# EAGLE design iot scheme (EAGLE 9.6.2)
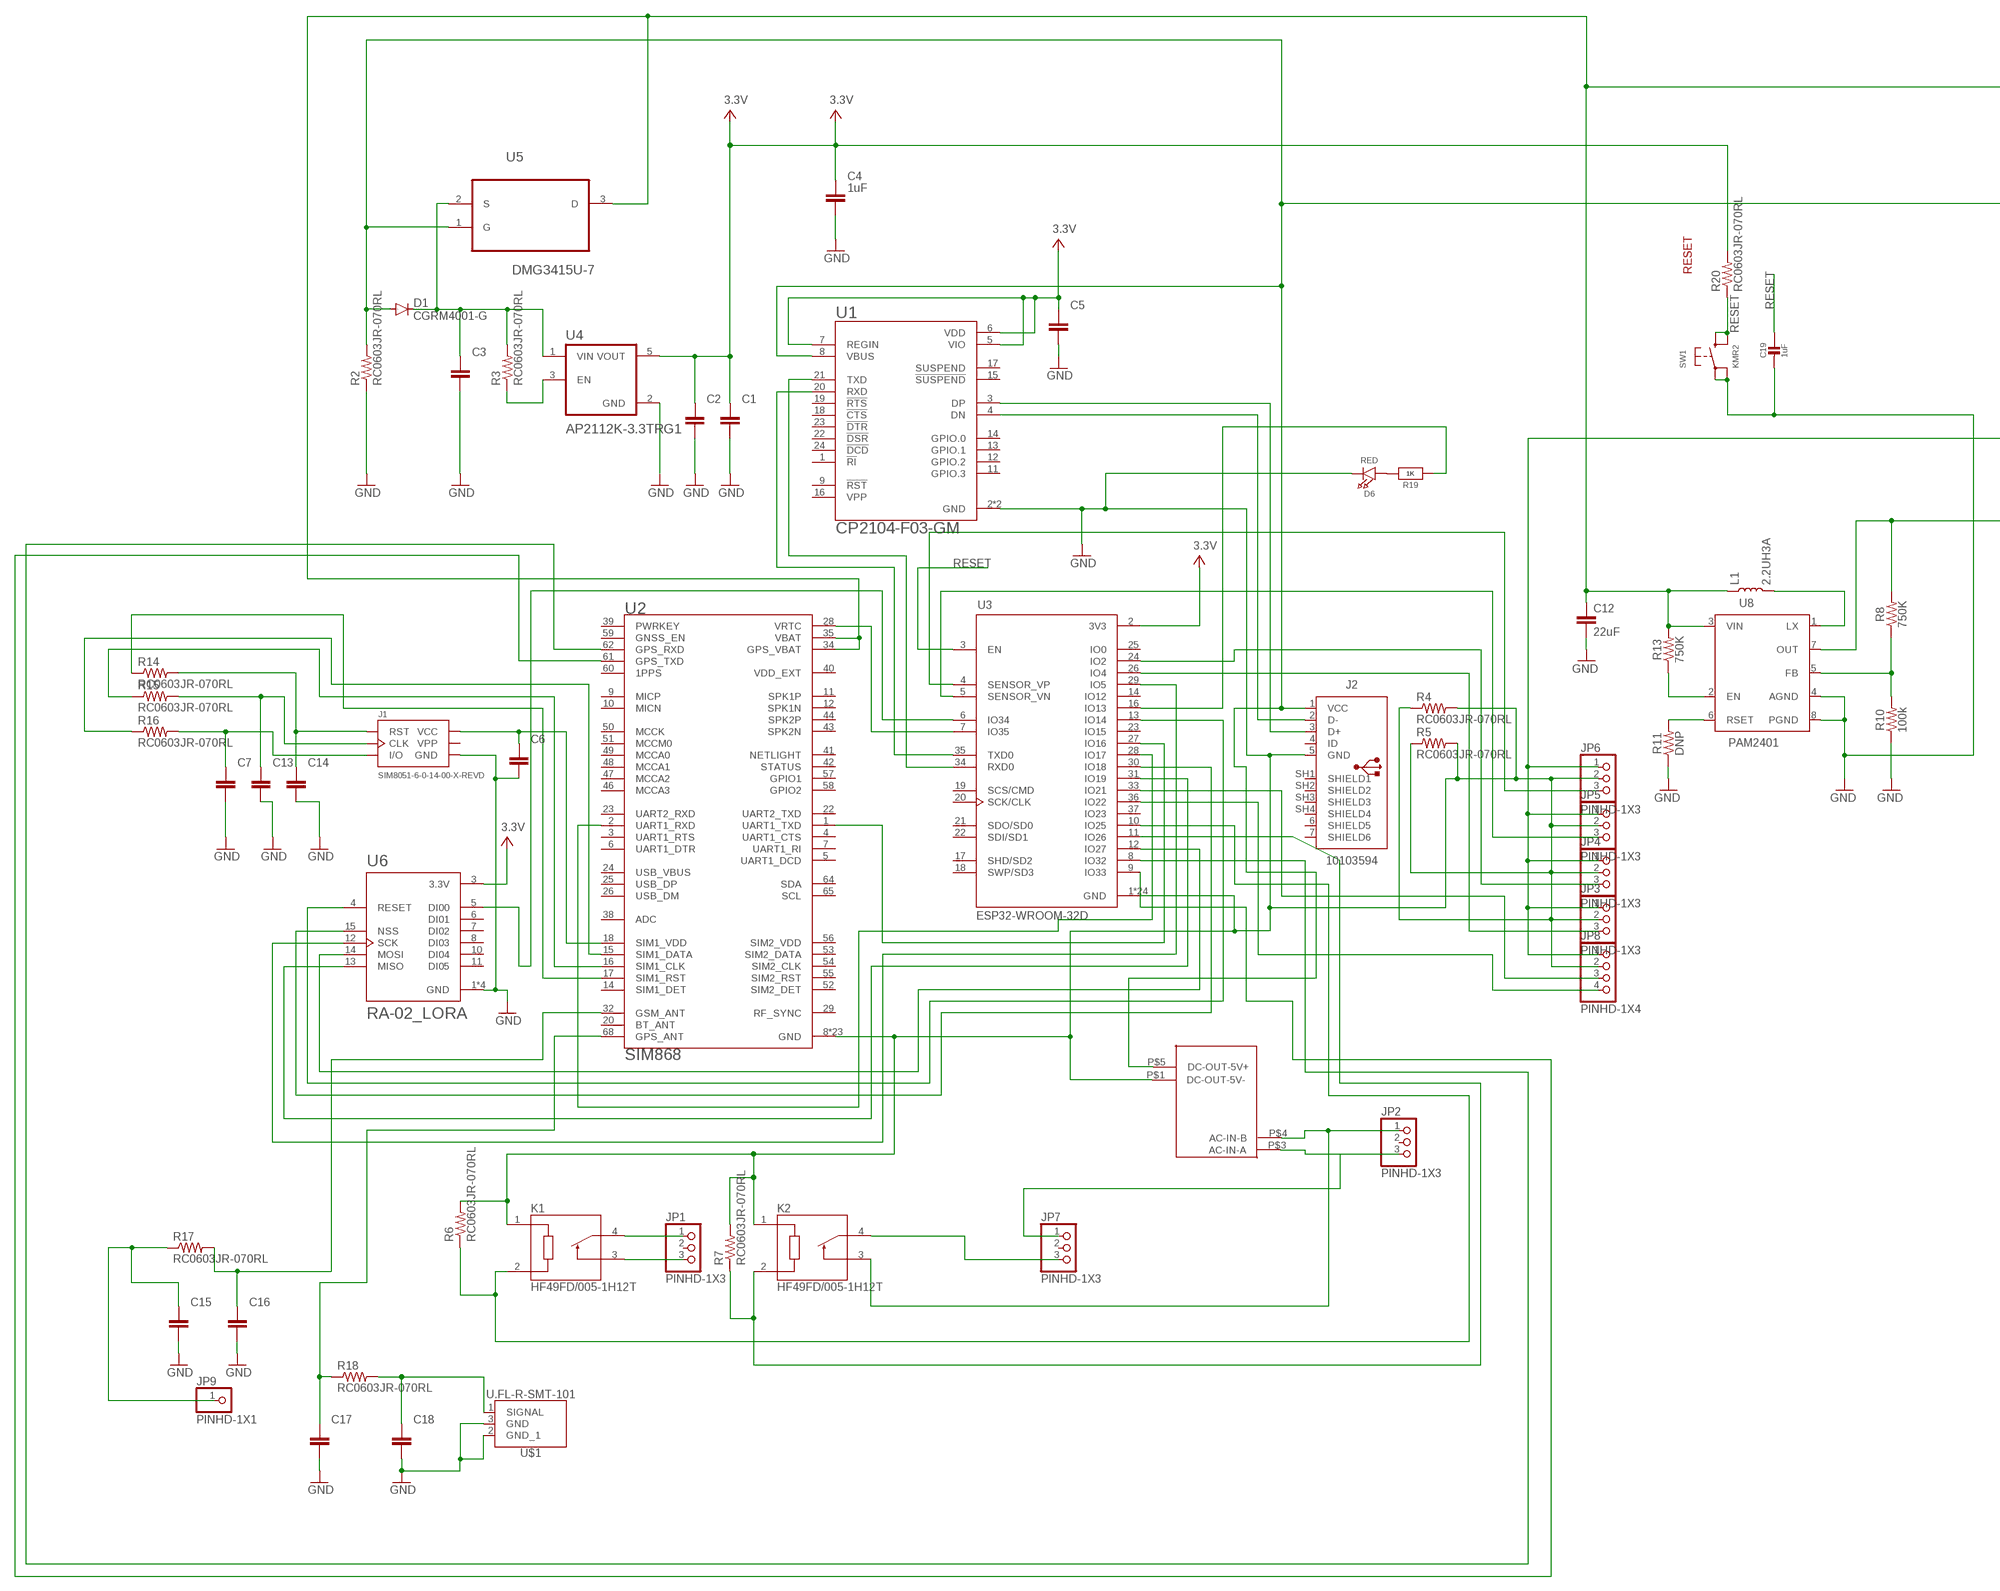
[diagram p0: schematic, sheet 1, part 1 of 2]
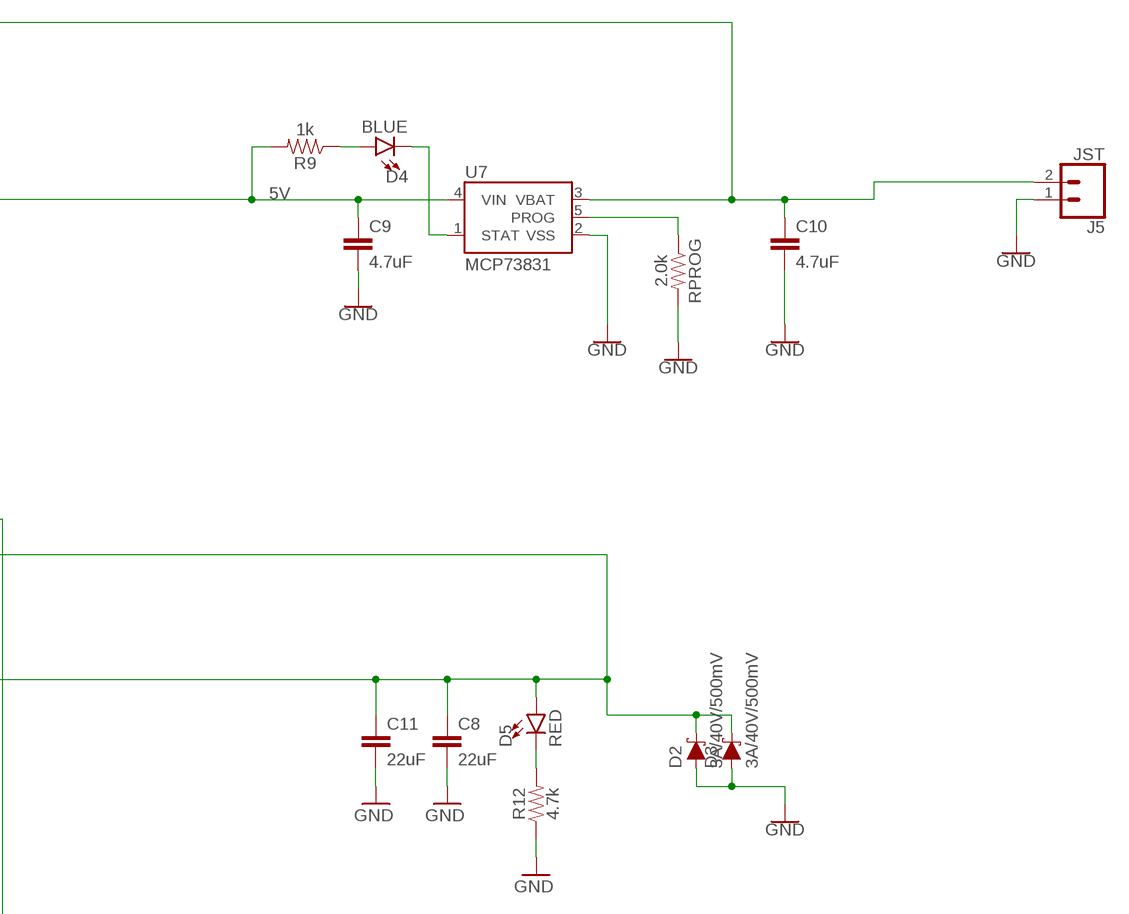
[diagram p1: schematic, sheet 1, part 2 of 2]

## Parts
C1  C_CHIP-0603(1608-METRIC)  [CAPC1608X85]
C2  C_CHIP-0603(1608-METRIC)  [CAPC1608X85]
C3  C_CHIP-0603(1608-METRIC)  [CAPC1608X85]
C4  1uF  C_CHIP-0603(1608-METRIC)  [CAPC1608X85]
C5  C_CHIP-0603(1608-METRIC)  [CAPC1608X85]
C6  C_CHIP-0603(1608-METRIC)  [CAPC1608X85]
C7  C_CHIP-0603(1608-METRIC)  [CAPC1608X85]
C8  22uF  22UF-0805-6.3V-20%  [0805]
C9  4.7uF  4.7UF0603  [0603]
C10  4.7uF  4.7UF0603  [0603]
C11  22uF  22UF-0805-6.3V-20%  [0805]
C12  22uF  22UF-0805-6.3V-20%  [0805]
C13  C_CHIP-0603(1608-METRIC)  [CAPC1608X85]
C14  C_CHIP-0603(1608-METRIC)  [CAPC1608X85]
C15  C_CHIP-0603(1608-METRIC)  [CAPC1608X85]
C16  C_CHIP-0603(1608-METRIC)  [CAPC1608X85]
C17  C_CHIP-0603(1608-METRIC)  [CAPC1608X85]
C18  C_CHIP-0603(1608-METRIC)  [CAPC1608X85]
C19  1uF  CAP_CERAMIC0603_NO  [0603-NO]
D1  CGRM4001-G  [SOD-123_MINI-SMA]
D2  3A/40V/500mV  DIODE-SCHOTTKY-B340A  [SMA-DIODE]
D3  3A/40V/500mV  DIODE-SCHOTTKY-B340A  [SMA-DIODE]
D4  BLUE  LED-BLUE0603  [LED-0603]
D5  RED  LED-RED0603  [LED-0603]
D6  RED  LED0805_NOOUTLINE  [CHIPLED_0805_NOOUTLINE]
J1  SIM8051-6-0-14-00-X-REVD  [GCT_SIM8051-6-0-14-00-X-REVD]
J2  10103594  [10103594]
J5  JST  CONN_02-JST-2MM-SMT  [JST-2-SMD]
JP1  PINHD-1X3  [1X03]
JP2  PINHD-1X3  [1X03]
JP3  PINHD-1X3  [1X03]
JP4  PINHD-1X3  [1X03]
JP5  PINHD-1X3  [1X03]
JP6  PINHD-1X3  [1X03]
JP7  PINHD-1X3  [1X03]
JP8  PINHD-1X4  [1X04]
JP9  PINHD-1X1  [1X01]
K1  HF49FD/005-1H12T  [RELAY_HF49FD/005-1H12T]
K2  HF49FD/005-1H12T  [RELAY_HF49FD/005-1H12T]
L1  2.2UH3A  INDUCTOR-IFSC1515AHER2R2M01  [INDUCTOR_4X4MM]
R1  AC-DC-5V  [MYFOOT]
R2  RC0603JR-070RL  [RES_0603]
R3  RC0603JR-070RL  [RES_0603]
R4  RC0603JR-070RL  [RES_0603]
R5  RC0603JR-070RL  [RES_0603]
R6  RC0603JR-070RL  [RES_0603]
R7  RC0603JR-070RL  [RES_0603]
R8  750K  750KOHM-0603-1/10W-1%  [0603]
R9  1k  1KOHM-0603-1/10W-1%  [0603]
R10  100k  100KOHM-0603-1/10W-1%  [0603]
R11  DNP  100KOHM-0603-1/10W-1%  [0603]
R12  4.7k  4.7KOHM-0603-1/10W-1%  [0603]
R13  750K  750KOHM-0603-1/10W-1%  [0603]
R14  RC0603JR-070RL  [RES_0603]
R15  RC0603JR-070RL  [RES_0603]
R16  RC0603JR-070RL  [RES_0603]
R17  RC0603JR-070RL  [RES_0603]
R18  RC0603JR-070RL  [RES_0603]
R19  1K  RESISTOR_0603_NOOUT  [0603-NO]
R20  RC0603JR-070RL  [RES_0603]
RPROG  2.0k  2.0KOHM-0603-1/10W-5%  [0603]
SW1  KMR2  SWITCH_TACT_SMT4.6X2.8  [BTN_KMR2_4.6X2.8]
U1  CP2104-F03-GM  [QFN50P400X400X80-25N]
U2  SIM868  [XCVR_SIM868]
U3  ESP32-WROOM-32D  [MODULE_ESP32-WROOM-32D]
U4  AP2112K-3.3TRG1  [SOT95P285X140-5N]
U5  DMG3415U-7  [SOT95P240X105-3N]
U6  RA-02_LORA  [MODULE_RA-02_LORA]
U7  MCP73831  [SOT23-5]
U8  PAM2401  [MSOP8]
U$1  U.FL-R-SMT-101  [U.FL-R-SMT-1(XX)]

## Nets
5V: C9.1 D1.A J2.1(VCC) R1.P$5(DC-OUT-5V+) R2.2 R9.2 U1.8(VBUS) U5.1(G) U7.4(VIN)
EN: R13.1 U8.2(EN)
GND: C1.2 C2.2 C3.2 C4.2 C5.2 C6.2 C7.2 C8.2 C9.2 C10.2 C11.2 C12.2 C13.2 C14.2 C15.2 C16.2 C17.2 C18.2 C19.2 D2.A D3.A D6.C J1.C5(GND) J2.5(GND) J5.1 JP3.2 JP4.2 JP5.2 JP6.2 JP8.2 K1.1(L1) K2.1(L1) R1.P$1(DC-OUT-5V-) R2.1 R4.1 R4.2 R5.1 R5.2 R6.2 R7.2 R10.1 R11.1 R12.1 RPROG.2 SW1.A'(P1) SW1.A(P) U1.2(GND) U1.25(GND) U2.8(GND) U2.13(GND) U2.19(GND) U2.21(GND) U2.27(GND) U2.30(GND) U2.31(GND) U2.33(GND) U2.36(GND) U2.37(GND) U2.45(GND) U2.63(GND) U2.66(GND) U2.67(GND) U2.69(GND) U2.70(GND) U2.71(GND) U2.72(GND) U2.73(GND) U2.74(GND) U2.75(GND) U2.76(GND) U2.77(GND) U3.1(GND) U3.15(GND) U3.38(GND) U3.39_1(GND) U3.39_2(GND) U3.39_3(GND) U3.39_4(GND) U3.39_5(GND) U3.39_6(GND) U3.39_7(GND) U3.39_8(GND) U3.39_9(GND) U3.39_10(GND) U3.39_11(GND) U3.39_12(GND) U3.39_13(GND) U3.39_14(GND) U3.39_15(GND) U3.39_16(GND) U3.39_17(GND) U3.39_18(GND) U3.39_19(GND) U3.39_20(GND) U3.39_21(GND) U4.2(GND) U6.1(GND) U6.2(GND) U6.9(GND) U6.16(GND) U7.2(VSS) U8.4(AGND) U8.8(PGND) U$1.2(GND_1) U$1.3(GND)
N$1: L1.P$2 U8.1(LX)
N$2: J2.3(D+) U1.3(DP)
N$3: J2.2(D-) U1.4(DN)
N$4: R3.1 U4.3(EN)
N$5: U1.20(RXD) U3.35(TXD0)
N$6: U1.21(TXD) U3.34(RXD0)
N$7: C3.1 D1.C R3.2 U4.1(VIN) U5.2(S)
N$8: R11.2 U8.6(RSET)
N$9: JP2.1 K2.3(C2) R1.P$4(AC-IN-B)
N$10: D5.C R12.2
N$11: RPROG.1 U7.5(PROG)
N$12: R8.1 R10.2 U8.5(FB)
N$13: D4.A R9.1
N$14: D4.C U7.1(STAT)
N$15: JP2.3 JP7.1 R1.P$3(AC-IN-A)
N$16: JP1.1 K1.4(C1)
N$17: JP1.3 K1.3(C2)
N$18: JP7.3 K2.4(C1)
N$19: JP6.3 U3.4(SENSOR_VP)
N$20: D6.A R19.2
N$21: JP5.3 U3.5(SENSOR_VN)
N$22: JP8.3 U3.33(IO21)
N$23: JP8.4 U3.36(IO22)
N$24: JP4.3 U3.24(IO2)
N$25: JP3.3 U3.26(IO4)
N$26: U3.13(IO14) U6.4(RESET)
N$27: K1.2(L2) R6.1 U3.10(IO25)
N$28: K2.2(L2) R7.1 U3.11(IO26)
N$29: U3.30(IO18) U6.15(NSS)
N$30: U3.12(IO27) U6.14(MOSI)
N$31: U3.31(IO19) U6.13(MISO)
N$32: U3.29(IO5) U6.12(SCK)
N$33: U3.6(IO34) U6.5(DI00)
N$34: U2.1(UART1_TXD) U3.27(IO16)
N$35: U2.2(UART1_RXD) U3.28(IO17)
N$36: C6.1 J1.C1(VCC) U2.18(SIM1_VDD)
N$37: R15.1 U2.16(SIM1_CLK)
N$38: R14.1 U2.17(SIM1_RST)
N$39: C14.1 J1.C2(RST) R14.2
N$40: C13.1 J1.C3(CLK) R15.2
N$41: C7.1 J1.C7(I/O) R16.2
N$42: R16.1 U2.15(SIM1_DATA)
N$43: C16.1 R17.2 U2.32(GSM_ANT)
N$44: C17.1 R18.1 U2.68(GPS_ANT)
N$45: C15.1 JP9.1 R17.1
N$46: U2.28(VRTC) U3.7(IO35)
N$47: C18.1 R18.2 U$1.1(SIGNAL)
N$48: C8.1 C11.1 D2.C D3.C D5.A JP3.1 JP4.1 JP5.1 JP6.1 JP8.1 R8.2 U8.7(OUT)
N$49: U2.62(GPS_RXD) U3.8(IO32)
N$50: R19.1 U3.16(IO13)
N$52: U2.61(GPS_TXD) U3.9(IO33)
RESET: C19.1 R20.1 SW1.B'(S1) SW1.B(S) U3.3(EN)
V+: C1.1 C2.1 C4.1 C5.1 R20.2 U1.5(VIO) U1.6(VDD) U1.7(REGIN) U3.2(3V3) U4.5(VOUT) U6.3(3.3V) ; supply symbol labelled 3.3V
VBATT: C10.1 C12.1 J5.2 L1.P$1 R13.2 U2.34(GPS_VBAT) U2.35(VBAT) U5.3(D) U7.3(VBAT) U8.3(VIN)
Unconnected: J2.4(ID) J2.6(SHIELD5) J2.7(SHIELD6) J2.SH1(SHIELD1) J2.SH2(SHIELD2) J2.SH3(SHIELD3) J2.SH4(SHIELD4) JP1.2 JP2.2 JP7.2 U1.1(!RI) U1.9(!RST!) U1.11(GPIO.3) U1.12(GPIO.2) U1.13(GPIO.1) U1.14(GPIO.0) U1.15(!SUSPEND!) U1.16(VPP) U1.17(SUSPEND) U1.18(!CTS) U1.19(!RTS) U1.22(!DSR) U1.23(!DTR) U1.24(!DCD) U2.3(UART1_RTS) U2.4(UART1_CTS) U2.5(UART1_DCD) U2.6(UART1_DTR) U2.7(UART1_RI) U2.9(MICP) U2.10(MICN) U2.11(SPK1P) U2.12(SPK1N) U2.14(SIM1_DET) U2.20(BT_ANT) U2.22(UART2_TXD) U2.23(UART2_RXD) U2.24(USB_VBUS) U2.25(USB_DP) U2.26(USB_DM) U2.29(RF_SYNC) U2.38(ADC) U2.39(PWRKEY) U2.40(VDD_EXT) U2.41(NETLIGHT) U2.42(STATUS) U2.43(SPK2N) U2.44(SPK2P) U2.46(MCCA3) U2.47(MCCA2) U2.48(MCCA1) U2.49(MCCA0) U2.50(MCCK) U2.51(MCCM0) U2.52(SIM2_DET) U2.53(SIM2_DATA) U2.54(SIM2_CLK) U2.55(SIM2_RST) U2.56(SIM2_VDD) U2.57(GPIO1) U2.58(GPIO2) U2.59(GNSS_EN) U2.60(1PPS) U2.64(SDA) U2.65(SCL) U3.14(IO12) U3.17(SHD/SD2) U3.18(SWP/SD3) U3.19(SCS/CMD) U3.20(SCK/CLK) U3.21(SDO/SD0) U3.22(SDI/SD1) U3.23(IO15) U3.25(IO0) U3.37(IO23) U6.6(DI01) U6.7(DI02) U6.8(DI03) U6.10(DI04) U6.11(DI05)

## Notes on the sheet
- RESET

## Power pins joined to a net without a drawn wire
VPP: J1.C6(VPP)

## Library data of the parts
C1-C7 C13-C18 = Capacitor:C: Capacitor - Generic; CATEGORY: Capacitor
C8 C11 C12 = SparkFun-Capacitors:22UF: 22µF ceramic capacitors A capacitor is a passive two-terminal electrical component used to store electrical energy temporarily in an electric field.; PROD_ID: CAP-08402
C9 C10 = SparkFun-Capacitors:4.7UF: 4.7µF ceramic capacitors A capacitor is a passive two-terminal electrical component used to store electrical energy temporarily in an electric field.; PROD_ID: CAP-08280
C19 = microbuilder:CAP_CERAMIC: Ceramic Capacitors For new designs, use the packages preceded by an '_' character since they are more reliable: The following footprints should be used on most boards: _0402 - Standard footprint for regular board layouts _0603 - Standard footprint for regular board layouts _0805 - Standard footprint for regular board layouts _1206 - Standard footprint for regular board layouts For extremely tight-pitch boards where space is at a premium, the following 'micro-pitch' footprints can be used (smaller pads, no silkscreen outline, etc.): _0402MP - Micro-pitch footprint for very dense/compact boards _0603MP - Micro-pitch footprint for very dense/compact boards _0805MP - Micro-pitch footprint for very dense/compact boards _1206MP - Micro-pitch footprint for very dense/compact boards
D1 = diode:CGRM400*-G: Molded plasitc,JEDEC SOD-123/Mini SMA Source: Comchip CGRM4001-G.pdf
D2 D3 = SparkFun-DiscreteSemi:DIODE-SCHOTTKY: Schottky diode A Schottky diode is a semiconductor diode which has a low forward voltage drop and a very fast switching action.; PROD_ID: DIO-09886
D4 = SparkFun-LED:LED-BLUE: Blue SMD LED Used in manufacturing of various products at SparkFun Packages: 0603 - SMD 0603 package [Product Link] <http://www.digikey.com/product-detail/en/SMLE12BC7TT86/511-1589-2-ND/1641808> 1206 - SMD1206 package [Product Link] <http://www.digikey.com/product-detail/en/lite-on-inc/LTST-C150TBKT/160-1643-1-ND/573584> SparkFun Products: ESP8266 Thing-Dev Board <https://www.sparkfun.com/products/13711> RedBoard <https://www.sparkfun.com/products/12757>; PROD_ID: DIO-08575
D5 = SparkFun-LED:LED-RED: Red SMD LED Used in manufacturing of most products at SparkFun Packages: 0603 - SMD 0603 package [Product Link] <http://docs.avagotech.com/docs/AV02-0551EN> 0603 SMART - SMD 0603 SMART package ( more efficient and expensive)[Product Link] <http://www.osram-os.com/Graphics/XPic2/00077099_0.pdf> 1206 - SMD1206 package [Product Link] <https://www.sparkfun.com/datasheets/DevTools/LilyPad/Q150OVS4.pdff> SparkFun Products: Pro Mini 328 -5V <https://www.sparkfun.com/products/821> RedBoard <https://www.sparkfun.com/products/12757> IOIO-OTG <https://www.sparkfun.com/products/13613>; PROD_ID: DIO-00819
D6 = microbuilder:LED: LED 0603 - 0603 Surface Mount Package 2mA: Green LED - Low Power (3.9mcd, 2ma, 1.7Vf) - Digikey: 475-2709-2-ND Orange LED - Low Power (9.8mcd, 2ma, 1.8Vf) - Digikey: 475-1194-2-ND Red LED - Low Power (5mcd, 2ma, 1.8Vf) - Digikey: 475-1195-2-ND Yellow LED - Low Power (7mcd, 2ma, 1.8Vf) - Digikey: 475-1196-2-ND 5mA: Blue LED - Low Power (17mcd, 5ma, 2.9Vf) - Digikey: LNJ937W8CRACT-ND 0805 - 0805 Surface Mount Package 2mA: Red LED (8.8mcd, 2mA, 1.8Vf, Clear) - Low Power [Digikey: 475-2510-1-ND] Green LED (5mcd, 2mA, 1.8Vf, Clear) - Low Power [Digikey: 475-2730-1-ND] Yellow LED (11.3mcd, 2mA, 1.8Vf, Clear) - Low Power [Digikey: 475-2555-1-ND] 20mA: Red LED (104mcd, 20mA, Diffused) - LS R976 [Digikey: 475-1278-6-ND] Red LED (12mcd, 20mA, 2.0Vf, Clear) - APT2012EC [Digikey: 754-1128-1-ND] Green LED (15mcd, 20mA, 2.2Vf, Clear) - APT2012GC [Digikey: 754-1131-1-ND] Orange LED (160mcd, 20mA, 2.1Vf, Clear) - APT2012SECK [Digikey: 754-1130-1-ND] 1206 - 1206 Surface Mount Package Green LED (26mcd, 20mA, Diffused) - LG N971 [Digikey: 475-1407-6-ND] Red LED (15mcd, 20mA, Diffused) - LH N974 [Digikey: 475-1416-6-ND] Cree - Cree High-Power Surface Mount LEDs XPEBWT-L1-0000-00D50 - White 111lm 350mA 2.9Vf 6200K 110° XTEAWT-00-0000-00000LEE3 - White 114lm 350mA 2.85Vf 5000K 115° Everlight - Everlight 45-21 Series Surface Mount LEDs 45-21/QK2C-B2832AC2CB2/2T - Warm White 2000mcd 20mA 3.25Vf 3050K 120° 45-21/LK2C-B38452C4CB2/2T - Nuetral White 2000mcd 20mA 3.25Vf 4150K 120° 45-21/LK2C-B50634C6CB2/2T - Cold White 2200mcd 20mA 3.25Vf 5650K 120° PLCC2 Reverse Mount LS T77K-J1L2-1-0-2-R18-Z - Red 11.25mcd 2mA 1.8Vf 630nm 120° LO T77K-L1M2-24-Z - Orange 19.6mcd 2mA 1.8Vf 606nm 120° LY T77K-K2M1-26-Z - Yellow 15.7mcd 2mA 1.8Vf 587nm 120°
J1 = SIM8051-6-0-14-00-X-REVD:SIM8051-6-0-14-00-X-REVD: Nano SIM Card Connector, Push-Pull Type, 6 Pin, SMT, Profile 1.35mm Check prices <https://pricing.snapeda.com/parts/SIM8051-6-0-14-00-A/Global%20Connector%20Technology/view-part?ref=eda>; AVAILABILITY: In Stock; DESCRIPTION: 6 Position Card Connector NANO SIM Surface Mount, Right Angle Gold; MF: Global Connector Technology; MP: SIM8051-6-0-14-00-A; PACKAGE: None; PRICE: None
J2 = Connector_USB:10103594: USB(2.0) Micro-B, RCPT, 5POS, SMD-THT-R/A Datasheet <https://cdn.amphenol-icc.com/media/wysiwyg/files/documentation/datasheet/inputoutput/io_usb_micro.pdf> Drawing <https://cdn.amphenol-icc.com/media/wysiwyg/files/drawing/10103594.pdf>; CATEGORY: Connectors; CONTACTS: 5; CURRENT-RATING: 1.8A; DESCRIPTION: CONN RCPT USB2.0 MICRO B SMD R/A; GENDER: Receptacle; MANUFACTURER: Amphenol ICC (FCI); MOUNT_TYPE: R/A; MPN: 10103594-0001LF; OPERATING_TEMPERATURE: -30°C ~ 80°C; PART_STATUS: ACTIVE; ROHS_COMPLIANT: COMPLIANT; SUB_CATEGORY: USB; TYPE: USB-micro B; VOLTAGE-RATING: 100VAC
J5 = SparkFun-Connectors:CONN_02: Multi connection point. Often used as Generic Header-pin footprint for 0.1 inch spaced/style header connections On any of the 0.1 inch spaced packages, you can populate with these: Break Away Headers - Straight <https://www.sparkfun.com/products/116> (PRT-00116) Break Away Male Headers - Right Angle <https://www.sparkfun.com/products/553> (PRT-00553) Female Headers <https://www.sparkfun.com/products/115> (PRT-00115) Break Away Headers - Machine Pin <https://www.sparkfun.com/products/117> (PRT-00117) Break Away Female Headers - Swiss Machine Pin <https://www.sparkfun.com/products/743> (PRT-00743) For SCREWTERMINALS and SPRING TERMINALS visit here: Screw Terimnals on SparkFun.com <https://www.sparkfun.com/search/results?term=Screw+Terminals> (5mm/3.5mm/2.54mm spacing) This device is also useful as a general connection point to wire up your design to another part of your project. Our various solder wires solder well into these plated through hole pads. Hook-Up Wire - Assortment (Stranded, 22 AWG) <https://www.sparkfun.com/products/11375> (PRT-11375) Hook-Up Wire - Assortment (Solid Core, 22 AWG) <https://www.sparkfun.com/products/11367> (PRT-11367) View the entire wire category on our website here <https://www.sparkfun.com/categories/141> Special notes: Molex polarized connector foot print use with: PRT-08233 with associated crimp pins and housings. 2.54_SCREWTERM for use with PRT-10571. 3.5mm Screw Terminal footprints for PRT-08084 5mm Screw Terminal footprints for use with PRT-08432; PROD_ID: CONN-11443
JP1-JP7 = Connector:PINHD-1X3: PIN HEADER; CATEGORY: CONNECTOR; SUB-CATEGORY: PIN-HEADER
JP8 = Connector:PINHD-1X4: PIN HEADER; CATEGORY: CONNECTOR; SUB-CATEGORY: PIN-HEADER
JP9 = Connector:PINHD-1X1: PIN HEADER; CATEGORY: CONNECTOR; SUB-CATEGORY: PIN-HEADER
K1 K2 = HF49FD_005-1H12T:HF49FD/005-1H12T: Relay: electromagnetic; SPST-NO; Ucoil: 5VDC; 5A/250VAC; 5A/30VDC Check prices <https://pricing.snapeda.com/parts/HF49FD/005-1H12T/Hongfa/view-part?ref=eda>; AVAILABILITY: No availability data; DESCRIPTION: Relay: electromagnetic; SPST-NO; Ucoil: 5VDC; 5A/250VAC; 5A/30VDC; MF: Hongfa; MP: HF49FD/005-1H12T; PACKAGE: None; PRICE: None
L1 = SparkFun-Coils:INDUCTOR: Inductors Resist changes in electrical current. Basically a coil of wire. SparkFun Products: SparkFun Load Cell Amplifier - HX711 <https://www.sparkfun.com/products/13879> IOIO-OTG - V2.2 <https://www.sparkfun.com/products/13613>; PROD_ID: NDUC-13770
R1 = my1:AC-DC-5V
R2-R7 R14-R18 R20 = Resistor_Capacitor:RC0603JR-070RL: RES SMD 0 OHM JUMPER 1/10W 0603 Manufacturer's datasheet <http://www.yageo.com/documents/recent/PYu-RC_Group_51_RoHS_L_10.pdf>; CREATED_BY: PCBLayout.com; DIGIKEY_PART_NUMBER: 311-0.0GRTR-ND; MANUFACTURER: Yageo; MPN: RC0603JR-070RL; PACKAGE: SMD 0603
R8 R13 = SparkFun-Resistors:750KOHM: 750Ω resistor A resistor is a passive two-terminal electrical component that implements electrical resistance as a circuit element. Resistors act to reduce current flow, and, at the same time, act to lower voltage levels within circuits. - Wikipedia; PROD_ID: RES-13768
R9 = SparkFun-Resistors:1KOHM: 1kΩ resistor A resistor is a passive two-terminal electrical component that implements electrical resistance as a circuit element. Resistors act to reduce current flow, and, at the same time, act to lower voltage levels within circuits. - Wikipedia; PROD_ID: RES-07856
R10 = SparkFun-Resistors:100KOHM: 100kΩ resistor A resistor is a passive two-terminal electrical component that implements electrical resistance as a circuit element. Resistors act to reduce current flow, and, at the same time, act to lower voltage levels within circuits. - Wikipedia; PROD_ID: RES-07828
R11 = SparkFun-Resistors:100KOHM: 100kΩ resistor A resistor is a passive two-terminal electrical component that implements electrical resistance as a circuit element. Resistors act to reduce current flow, and, at the same time, act to lower voltage levels within circuits. - Wikipedia; PROD_ID: RES-07828; VALUE: 100k
R12 = SparkFun-Resistors:4.7KOHM: 4.7kΩ resistor A resistor is a passive two-terminal electrical component that implements electrical resistance as a circuit element. Resistors act to reduce current flow, and, at the same time, act to lower voltage levels within circuits. - Wikipedia; PROD_ID: RES-07857
R19 = microbuilder:RESISTOR: Resistors For new designs, use the packages preceded by an '_' character since they are more reliable: The following footprints should be used on most boards: _0402 - Standard footprint for regular board layouts _0603 - Standard footprint for regular board layouts _0805 - Standard footprint for regular board layouts _1206 - Standard footprint for regular board layouts For extremely tight-pitch boards where space is at a premium, the following 'micro-pitch' footprints can be used (smaller pads, no silkscreen outline, etc.): _0402MP - Micro-pitch footprint for very dense/compact boards _0603MP - Micro-pitch footprint for very dense/compact boards _0805MP - Micro-pitch footprint for very dense/compact boards _1206MP - Micro-pitch footprint for very dense/compact boards
RPROG = SparkFun-Resistors:2.0KOHM: 2kΩ resistor A resistor is a passive two-terminal electrical component that implements electrical resistance as a circuit element. Resistors act to reduce current flow, and, at the same time, act to lower voltage levels within circuits. - Wikipedia; PROD_ID: RES-08296
SW1 = microbuilder:SWITCH_TACT_SMT: SMT Tact Switches 6x6mm - Digikey: P12940SCT-ND KMR2 (4.6x2.8mm) - Digikey: 401-1426-1-ND EVQ-PQHB55 - Light Touch, 160GF (4.5x4.5mm) - Digikey: P8090SCT-ND KMT0 - KMT021 NGJ LHS (etc.) IP68/Waterproof - Digikey: CKN10289CT-ND
U1 = CP2104:CP2104: Silabs CP2104 USB to UART Bridge Check prices <https://pricing.snapeda.com/parts/CP2104/Silicon%20Labs/view-part?ref=eda>; AVAILABILITY: In Stock; DESCRIPTION: USB Bridge, USB to UART USB 2.0 UART Interface 24-QFN (4x4); MF: Silicon Labs; MP: CP2104; PACKAGE: QFN-24 Silicon Labs; PRICE: None
U2 = SIM868 (1):SIM868: Gsm/Gprs+Gnss Module Check prices <https://pricing.snapeda.com/parts/SIM868/MikroElektronika/view-part?ref=eda>; AVAILABILITY: No availability data; DESCRIPTION: SIM868 GNSS, GSM RF mikroBUS™ Click™ Platform Evaluation Expansion Board; MF: MikroElektronika; MP: SIM868; PACKAGE: None; PRICE: None
U3 = ESP32-WROOM-32D:ESP32-WROOM-32D: Bluetooth, WiFi 802.11b/g/n, Bluetooth v4.2 + EDR, Class 1, 2 and 3 Transceiver Module 2.4GHz ~ 2.5GHz Integrated, Trace Surface Mount Check prices <https://pricing.snapeda.com/parts/ESP32-WROOM-32D/Espressif%20Systems/view-part?ref=eda>; AVAILABILITY: In Stock; DESCRIPTION: Bluetooth, WiFi 802.11b/g/n, Bluetooth v4.2 +EDR, Class 1, 2 and 3 Transceiver Module 2.4GHz ~ 2.5GHz Integrated; MF: Espressif Systems; MP: ESP32-WROOM-32D; PACKAGE: Module Espressif Systems; PRICE: None
U4 = AP2112K-3.3TRG1:AP2112K-3.3TRG1: AP2112 Series 0.6 A 3.3 V Fixed Output SMT LDO Linear Regulator - SOT23-5 Check prices <https://pricing.snapeda.com/parts/AP2112K-3.3TRG1/Diodes%20Zetex/view-part?ref=eda>; AVAILABILITY: In Stock; DESCRIPTION: LDO Regulator Pos 3.3V 0.6A 5-Pin SOT-23 T/R; MF: Diodes Zetex; MP: AP2112K-3.3TRG1; PACKAGE: None; PRICE: None
U5 = DMG3415U-7:DMG3415U-7: P-CHANNEL ENHANCEMENT MODE MOSFET Check prices <https://pricing.snapeda.com/parts/DMG3415U-7/Diodes%20Inc./view-part?ref=eda>; AVAILABILITY: Not in stock; DESCRIPTION: P-Channel 20V 4A (Ta) 900mW (Ta) Surface Mount SOT-23-3; MF: Diodes Inc.; MP: DMG3415U-7; PACKAGE: SOT-23 Diodes Inc.; PRICE: None
U6 = RA-02_LORA:RA-02_LORA: Ra-02 LoRa RF M5Stack Platform Evaluation Expansion Board Check prices <https://pricing.snapeda.com/parts/Ra-02%20LoRa/AI-Thinker/view-part?ref=eda>; AVAILABILITY: No availability data; DESCRIPTION: Ra-02 LoRa RF M5Stack Platform Evaluation Expansion Board; MF: AI-Thinker; MP: Ra-02 LoRa; PACKAGE: Package; PRICE: None
U7 = SparkFun-IC-Power:MCP73831: MCP73831T Li-Ion, Li-Pol Controller Miniature single cell, fully integrated Li-Ion, Li-polymer charge management controller Datasheet <http://ww1.microchip.com/downloads/en/DeviceDoc/20001984g.pdf> SparkFun Products: SparkFun ESP32 Thing <https://www.sparkfun.com/products/13907> SparkFun 9DoF Razor IMU M0 <https://www.sparkfun.com/products/14001>; PROD_ID: IC-09995
U8 = SparkFun-IC-Power:PAM2401: PAM2401 - Boost PMIC Specifications: Up to 1A output current 0.9V to 4.75V Input Range 2.5V to 5.0V Adjustable Output Voltage Datasheet <https://www.diodes.com/assets/Datasheets/PAM2401.pdf> (Diodes inc.); PROD_ID: IC-13769
U$1 = Connector:U.FL-R-SMT-1: U.FL (UMCC) Connector Receptacle, Male Pin 50Ohm Surface Mount Solder Datasheet <https://media.digikey.com/pdf/Data%20Sheets/Hirose%20PDFs/UFL%20Series.pdf> Drawing <https://www.hirose.com/product/document?clcode=CL0331-0472-2-10&productname=U.FL-R-SMT-1(10)&series=U.FL&documenttype=2DDrawing&lang=en&documentid=0000940684>; CATEGORY: Connector; DESCRIPTION: Ultra Small Surface Mount Coaxial Connectors; MANUFACTURER: Hirose Electric Co Ltd; MPN: U.FL-R-SMT-1(01); OPERATING_TEMPERATURE: -40˚C to +90˚C; PART_STATUS: Active; ROHS_COMPLIANCE: RoHS Compliant; SERIES: U.FL; TYPE: RF Connector

## Board
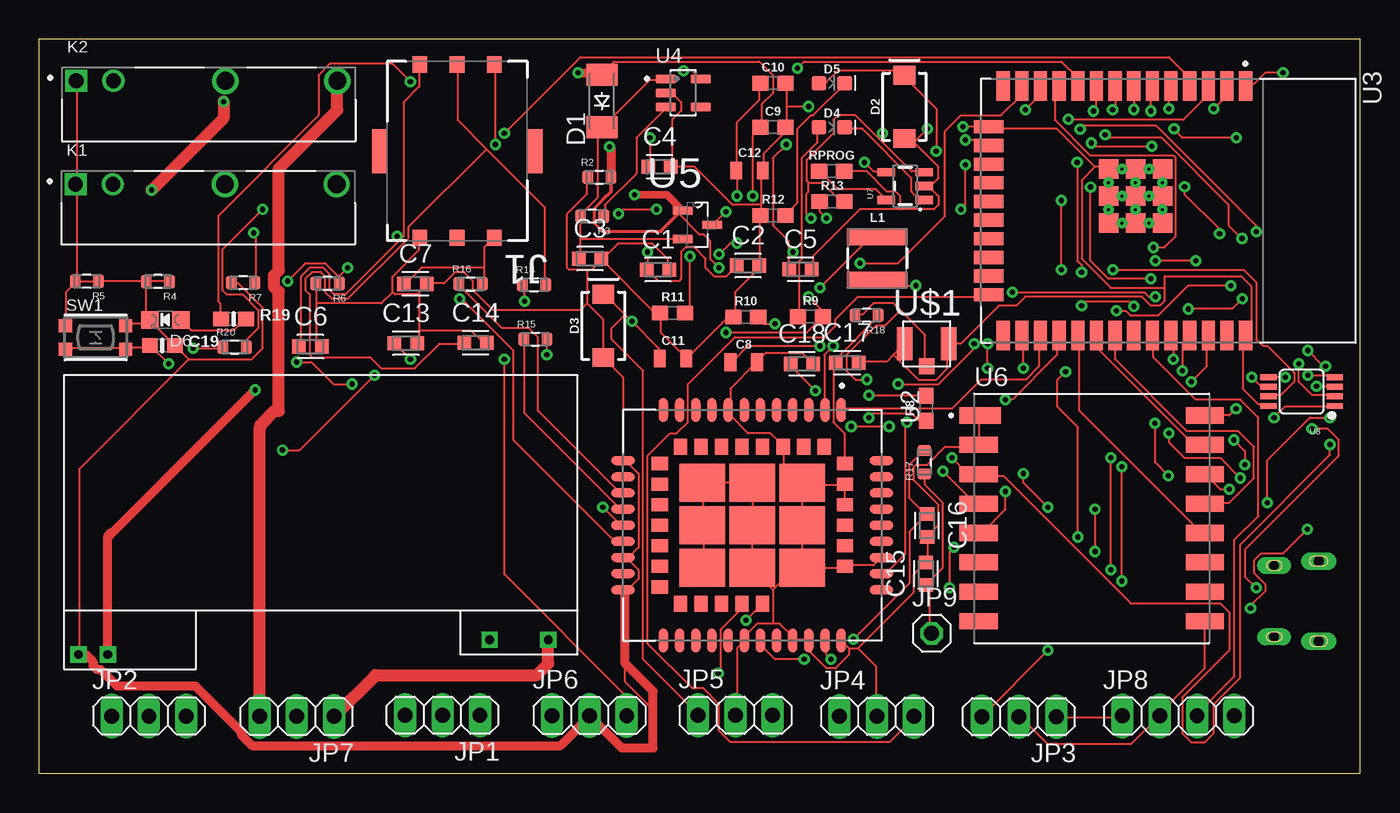
[diagram p2: board, top side]
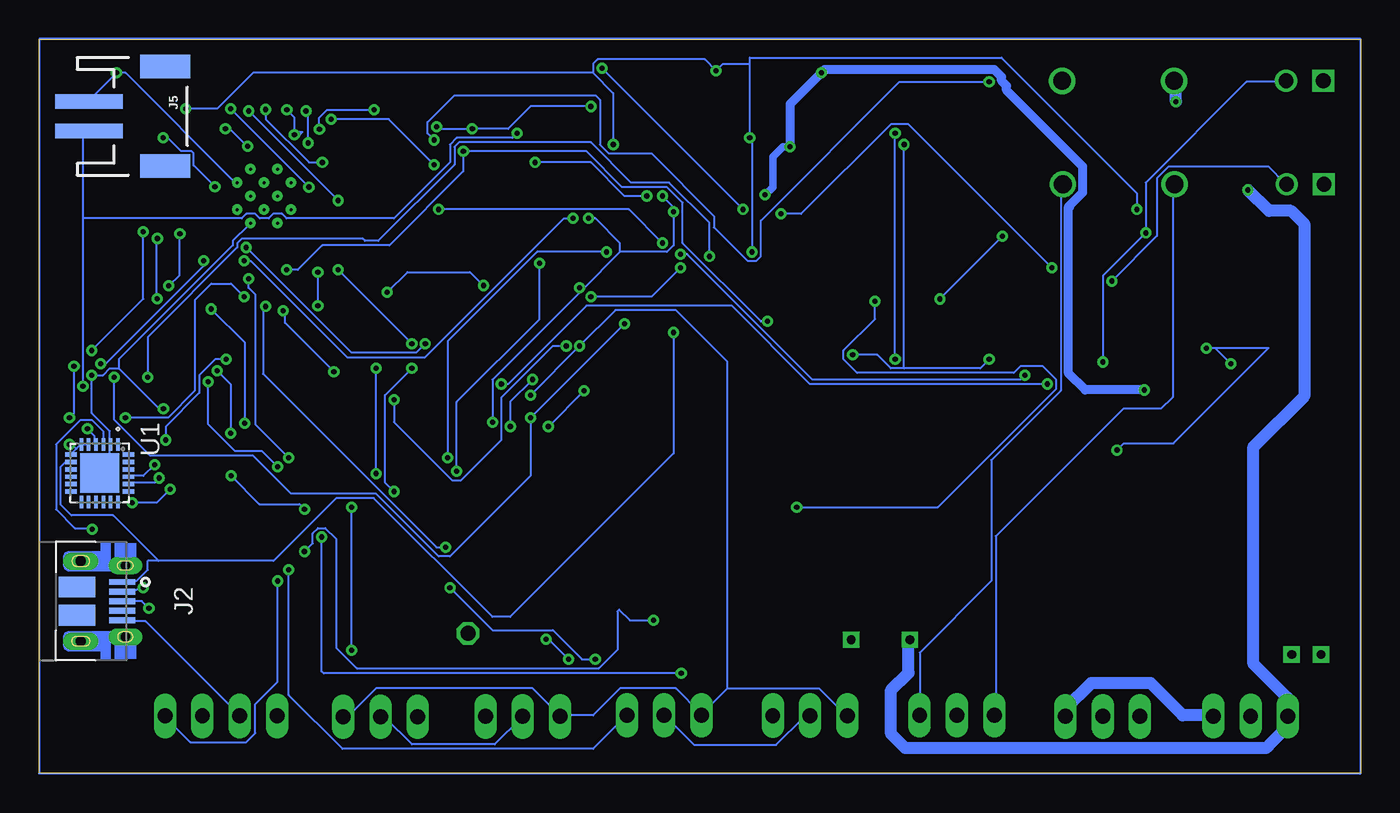
[diagram p3: board, bottom side, seen from below]

Size 90 x 50 mm. Coordinates in mm from the lower left corner, seen from the top.
Outline: 0,0 90,0 90,50 0,50 0,0
Copper layers (1*16): Top 0.035mm / dielectric 1.5mm / Bottom 0.035mm
Design rules "default": minimum track width 6mil, minimum drill 0.35mm, track to track 6mil, track to pad 6mil, pad to pad 6mil, via to via 6mil, smd to smd 6mil, copper to edge 40mil, drill to drill 6mil, minimum pad ring 10mil, minimum via ring 8mil, stop-mask expansion 4mil, vias tented up to drill 0mil, thermal gap 10mil

### Footprints (pad centres in the part's own frame; a part is rotated, then mirrored left to right if it is on the bottom)
CAPC1608X85 = smd 0.921 x 0.97: 1 -0.775,0; 2 0.775,0
0805 = smd 0.8 x 1.2: 1 -0.9,0; 2 0.9,0
0603 = smd 1.1 x 1: 1 -0.85,0; 2 0.85,0
0603-NO = smd 1.075 x 1: 1 -0.85,0; 2 0.85,0
SOD-123_MINI-SMA = smd 1.5 x 2.1: A 1.8,0; C -1.8,0
SMA-DIODE = smd 1.27 x 1.47: A -2.15,0; C 2.15,0
LED-0603 = smd 1 x 1: A -0.877,0; C 0.877,0
CHIPLED_0805_NOOUTLINE = smd 1.2 x 1.2: A 0,-1.05; C 0,1.05
GCT_SIM8051-6-0-14-00-X-REVD = smd 1 x 1.1: C1 2.54,-5.9; C2 0,-5.9; C3 -2.54,-5.9; C5 2.54,5.9; C6 0,5.9; C7 -2.54,5.9 | smd 1 x 3: C4 5.3,0; C8 -5.3,0
10103594 = smd 0.4 x 1.75: 1 -1.3,2.825; 2 -0.65,2.825; 3 0,2.825; 4 0.65,2.825; 5 1.3,2.825 | smd 1.425 x 2.5: 6 -0.963,-0.25; 7 0.963,-0.25 | drill 0.65 pad 0.73 long: SH1 -2.425,3.03; SH2 2.425,3.03 | drill 0.7 long: SH3 -2.725,0; SH4 2.725,0
JST-2-SMD = smd 1 x 4.6: 1 -1,-3.7; 2 1,-3.7 | smd 1.6 x 3.4: NC1 -3.4,1.5; NC2 3.4,1.5
1X03 = drill 1.016 long: 1 -2.54,0; 2 0,0; 3 2.54,0
1X04 = drill 1.016 long: 1 -3.81,0; 2 -1.27,0; 3 1.27,0; 4 3.81,0
1X01 = drill 1.016 octagon: 1 0,0
RELAY_HF49FD/005-1H12T = drill 1 square: 1 -9.03,1.6 | drill 1: 2 -6.49,1.6 | drill 1.2: 3 1.13,1.6; 4 8.75,1.6
INDUCTOR_4X4MM = smd 4.089 x 1.143: P$1 0,1.473; P$2 0,-1.473
MYFOOT = drill 0.6 square: P$1 19,-34; P$3 18,-2; P$4 18,-6; P$5 19,-32
RES_0603 = smd 0.74 x 0.93: 1 -0.795,0; 2 0.795,0
BTN_KMR2_4.6X2.8 = smd 0.9 x 0.9: A 2.05,0.8; A' -2.05,0.8; B 2.05,-0.8; B' -2.05,-0.8
QFN50P400X400X80-25N = smd 0.81 x 0.26: 1 -1.955,1.25; 2 -1.955,0.75; 3 -1.955,0.25; 4 -1.955,-0.25; 5 -1.955,-0.75; 6 -1.955,-1.25; 13 1.955,-1.25; 14 1.955,-0.75; 15 1.955,-0.25; 16 1.955,0.25; 17 1.955,0.75; 18 1.955,1.25 | smd 0.26 x 0.81: 7 -1.25,-1.955; 8 -0.75,-1.955; 9 -0.25,-1.955; 10 0.25,-1.955; 11 0.75,-1.955; 12 1.25,-1.955; 19 1.25,1.955; 20 0.75,1.955; 21 0.25,1.955; 22 -0.25,1.955; 23 -0.75,1.955; 24 -1.25,1.955 | smd 2.68 x 2.68: 25 0,0
XCVR_SIM868 = smd 1.6 x 0.6: 1 -7.85,6.05; 2 -7.85,4.95; 3 -7.85,3.85; 4 -7.85,2.75; 5 -7.85,1.65; 6 -7.85,0.55; 7 -7.85,-0.55; 8 -7.85,-1.65; 9 -7.85,-2.75; 10 -7.85,-3.85; 11 -7.85,-4.95; 12 -7.85,-6.05; 22 7.85,-6.05; 23 7.85,-4.95; 24 7.85,-3.85; 25 7.85,-2.75; 26 7.85,-1.65; 27 7.85,-0.55; 28 7.85,0.55; 29 7.85,1.65; 30 7.85,2.75; 31 7.85,3.85; 32 7.85,4.95; 33 7.85,6.05 | smd 0.6 x 1.6: 13 -4.4,-8.8; 14 -3.3,-8.8; 15 -2.2,-8.8; 16 -1.1,-8.8; 17 0,-8.8; 18 1.1,-8.8; 19 2.2,-8.8; 20 3.3,-8.8; 21 4.4,-8.8; 34 4.4,8.8; 35 3.3,8.8; 36 2.2,8.8; 37 1.1,8.8; 38 0,8.8; 39 -1.1,8.8; 40 -2.2,8.8; 41 -3.3,8.8; 42 -4.4,8.8 | smd 1.1 x 0.9: 43 -5.35,4.9; 44 -5.35,3.5; 45 -5.35,2.1; 46 -5.35,0.7; 47 -5.35,-0.7; 48 -5.35,-2.1; 49 -5.35,-3.5; 50 -5.35,-4.9; 58 5.35,-4.9; 59 5.35,-3.5; 60 5.35,-2.1; 61 5.35,-0.7; 62 5.35,0.7 | smd 0.9 x 1.1: 51 -4.2,-6.3; 52 -2.8,-6.3; 53 -1.4,-6.3; 54 0,-6.3; 55 1.4,-6.3; 56 2.8,-6.3; 57 4.2,-6.3; 63 2.8,6.3; 64 1.4,6.3; 65 0,6.3; 66 -1.4,6.3; 67 -2.8,6.3; 68 -4.2,6.3 | smd 2.6 x 3.1: 69 -2.9,3.4; 70 -2.9,0; 71 -2.9,-3.4; 72 0,-3.4; 73 2.9,-3.4; 74 2.9,0; 75 2.9,3.4; 76 0,3.4; 77 0,0
MODULE_ESP32-WROOM-32D = smd 2 x 0.9: 1 -8.5,5.26; 2 -8.5,3.99; 3 -8.5,2.72; 4 -8.5,1.45; 5 -8.5,0.18; 6 -8.5,-1.09; 7 -8.5,-2.36; 8 -8.5,-3.63; 9 -8.5,-4.9; 10 -8.5,-6.17; 11 -8.5,-7.44; 12 -8.5,-8.71; 13 -8.5,-9.98; 14 -8.5,-11.25; 25 8.5,-11.25; 26 8.5,-9.98; 27 8.5,-8.71; 28 8.5,-7.44; 29 8.5,-6.17; 30 8.5,-4.9; 31 8.5,-3.63; 32 8.5,-2.36; 33 8.5,-1.09; 34 8.5,0.18; 35 8.5,1.45; 36 8.5,2.72; 37 8.5,3.99; 38 8.5,5.26 | smd 0.9 x 2: 15 -5.715,-12.25; 16 -4.445,-12.25; 17 -3.175,-12.25; 18 -1.905,-12.25; 19 -0.635,-12.25; 20 0.635,-12.25; 21 1.905,-12.25; 22 3.175,-12.25; 23 4.445,-12.25; 24 5.715,-12.25 | smd 1.33 x 1.33: 39_1 -2.835,-0.405; 39_2 -1,-0.405; 39_3 0.835,-0.405; 39_4 -2.835,-2.24; 39_5 -1,-2.24; 39_6 0.835,-2.24; 39_7 -2.835,-4.075; 39_8 -1,-4.075; 39_9 0.835,-4.075 | drill 0.2 pad 0.3: 39_10 -1.917,-0.405; 39_11 -0.083,-0.405; 39_12 -2.835,-1.323; 39_13 -1,-1.323; 39_14 0.835,-1.323; 39_15 -1.917,-2.24; 39_16 -0.083,-2.24; 39_17 -2.835,-3.158; 39_18 -1,-3.158; 39_19 0.835,-3.158; 39_20 -1.917,-4.075; 39_21 -0.083,-4.075
SOT95P285X140-5N = smd 1.35 x 0.6: 1 -1.185,0.95; 2 -1.185,0; 3 -1.185,-0.95; 4 1.185,-0.95; 5 1.185,0.95
SOT95P240X105-3N = smd 1.321 x 0.559: 1 -1.016,0.965; 2 -1.016,-0.965; 3 1.016,0
MODULE_RA-02_LORA = smd 2.8 x 1.1: 1 -7.6,7 | smd 2.6 x 1.1: 2 -7.7,5; 3 -7.7,3; 4 -7.7,1; 5 -7.7,-1; 6 -7.7,-3; 7 -7.7,-5; 8 -7.7,-7; 9 7.7,-7; 10 7.7,-5; 11 7.7,-3; 12 7.7,-1; 13 7.7,1; 14 7.7,3; 15 7.7,5; 16 7.7,7
SOT23-5 = smd 0.55 x 1.2: 1 -0.95,-1.3; 2 0,-1.3; 3 0.95,-1.3; 4 0.95,1.3; 5 -0.95,1.3
MSOP8 = smd 0.4 x 1.1: 1 -0.975,-2.25; 2 -0.325,-2.25; 3 0.325,-2.25; 4 0.975,-2.25; 5 0.975,2.25; 6 0.325,2.25; 7 -0.325,2.25; 8 -0.975,2.25
U.FL-R-SMT-1(XX) = smd 1.05 x 1.1: 1 0,1.525 | smd 1.05 x 2.25: 2 -1.5,0; 3 1.5,0

### Placement (x,y rotation side)
C1  42.17,34.3 0 top
C2  48.3,34.58 0 top
C3  37.54,35.05 0 top
C4  42.27,41.3 0 top
C5  51.87,34.33 0 top
C6  18.49,29.07 0 top
C7  25.64,33.33 0 top
C8  48,28 0 top
C9  50,44 0 top
C10  50,47 0 top
C11  43.19,28.25 0 top
C12  48.4,41.05 0 top
C13  25,29.29 0 top
C14  29.74,29.32 0 top
C15  60.41,13.6 90 top
C16  60.49,16.88 270 top
C17  55.05,27.96 0 top
C18  51.97,27.89 0 top
C19  8.41,29.13 0 top
D1  38.35,45.79 90 top
D2  58.95,45.39 90 top
D3  38.45,30.48 90 top
D4  54,44 0 top
D5  54,47 0 top
D6  8.61,30.89 90 top
J1  28.49,42.38 180 top
J2  87.17,11.73 270 bottom
J5  82.91,44.75 270 bottom
JP1  27.49,3.97 180 top
JP2  7.49,3.91 0 top
JP3  66.75,3.86 180 top
JP4  57.07,3.89 0 top
JP5  47.43,3.97 0 top
JP6  37.5,3.94 0 top
JP7  17.56,3.89 180 top
JP8  77.61,3.92 0 top
JP9  60.8,9.54 0 top
K1  11.52,38.52 0 top
K2  11.57,45.56 0 top
L1  57.09,35.08 0 top
R1  36.69,27.1 270 top
R2  38.17,40.59 0 top
R3  37.69,37.95 180 top
R4  8.1,33.49 180 top
R5  3.26,33.52 180 top
R6  19.66,33.36 180 top
R7  13.91,33.42 180 top
R8  60.43,24.86 90 top
R9  52.55,31.1 0 top
R10  48.15,31.08 0 top
R11  43.16,31.36 0 top
R12  50,38 0 top
R13  54.03,38.94 0 top
R14  33.73,33.28 0 top
R15  33.82,29.57 0 top
R16  29.4,33.33 0 top
R17  60.3,21.2 90 top
R18  56.38,31.2 180 top
R19  13.26,30.94 0 top
R20  13.34,29.03 0 top
RPROG  54,41 0 top
SW1  3.86,29.69 0 top
U1  85.88,20.45 270 bottom
U2  48.59,16.9 270 top
U3  76.92,38.31 270 top
U4  43.88,46.35 0 top
U5  44.86,37.36 0 top
U6  71.7,17.37 0 top
U7  59,40 90 top
U8  86,26 90 top
U$1  60.47,29.25 180 top

### Tracks (layer width: path | path; a pad name or v marks a point on that pad's centre or on a via)
5V  (via drill 0.35)
  Top 0.152: 38.46,39.06 37.8,38.41 37.8,38.33 | 43.59,38.1 43.74,38.25 U5.1 43.59,38.1 | 43.59,38.1 42.39,36.91 | v52.43,32.46 53.34,31.55 53.34,31.24 R9.2 53.34,31.09 52.27,30.02 v46.79,30.02 | v46.33,34.44 45.72,35.05 45.72,36.27 45.26,36.73 44.96,36.73 43.59,38.1 | v56.24,41.6 56.84,41 57.61,41 U7.4 | v48.62,39.32 48.62,43.43 49.07,43.89 C9.1 49.23,44.04 49.23,45.57 49.99,46.33 49.99,47.55 49.07,48.46 39.17,48.46 38.41,47.7 D1.A 38.25,47.7 37.72,47.7 | v14.73,26.11 14.63,26.11 4.88,16.36
  Top 0.2: 38.43,39.09 37.8,38.45 37.8,38.33 37.8,37.49 38.38,36.91 42.29,36.91 | 42.29,36.91 42.39,36.91 | 42.29,36.91 43.64,38.25 43.74,38.25
  Top 0.254: R2.2 38.97,39.62 38.43,39.09
  Top 0.508: U5.1 42.77,39.4 v40.56,39.4
  Top 0.61: R1.P$5 4.69,16.17 | 4.88,16.36 4.69,16.17 | 4.69,16.17 4.79,16.17 v14.73,26.11 | v36.73,47.7 37.72,47.7 | v38.86,42.67 38.97,42.57 R2.2
  Bottom 0.152: 81.86,14.48 84.96,17.58 87.81,17.58 88.54,18.31 88.54,20.88 88.24,21.18 87.94,21.18 U1.8 | J2.1 84.28,13.11 83.36,13.11 82.6,13.87 82.6,14.48 81.86,14.48 | v52.43,32.46 48.31,32.46 v46.33,34.44 | 81.86,14.48 74.04,14.48 69.77,18.75 67.21,18.75 59.13,10.67 57.91,10.67 46.79,21.79 v46.79,30.02 | v56.24,41.6 52.43,41.6 50.14,39.32 v48.62,39.32 | 19.81,27.43 19.81,38.58 19.81,38.86 19.05,39.62 19.05,41.76 24.12,46.83 | v36.73,47.7 24.99,47.7
  Bottom 0.508: v40.56,39.4 40.03,39.93 40.03,41.99 39.34,42.67 v38.86,42.67
  Bottom 0.61: v14.73,26.11 18.76,26.11 19.89,27.24 19.89,38.51 | 19.89,38.51 19.81,38.58 | 19.89,38.51 19.89,38.59 18.92,39.56 18.92,41.33 24.12,46.53 24.12,46.83 24.46,47.17 24.46,47.44 24.95,47.93 36.5,47.93 v36.73,47.7 38.86,45.57 v38.86,42.67
EN  (via drill 0.35)
  Top 0.152: v53.65,37.8 53.19,38.25 53.19,38.86 R13.1 | v78.79,34.9 v76.05,34.9 | v85.8,27.89 85.8,26.67 86.72,25.76 88.24,25.76 U8.2
  Bottom 0.152: v53.65,37.8 54.25,37.8 63.7,28.35 69.04,28.35 75.59,34.9 v76.05,34.9 | v85.8,27.89 85.47,27.89 78.79,34.57 v78.79,34.9
GND  (via drill 0.35)
  Top 0.152: v86.41,27.13 88.24,27.13 U8.4 | v81.53,24.84 81.08,24.38 79.55,24.38 U6.16 | 58.67,38.41 60.96,38.41 61.27,38.71 61.27,39.32 60.66,39.93 | 58.67,38.41 55.93,38.41 52.73,35.2 52.73,34.44 C5.2 | 60.66,39.93 60.35,39.93 U7.2 60.66,39.93 | 58.67,38.41 58.67,39.32 58.37,39.62 57.76,39.62 56.39,41 54.86,41 RPROG.2 | 59.59,42.98 61.27,41.3 61.27,40.54 60.66,39.93 | 59.59,42.98 59.44,43.13 58.98,43.13 D2.A 59.59,42.98 | v84.73,47.7 83.52,47.7 82.75,46.94 82.3,46.94 U3.1 | 58.22,28.5 58.83,29.11 U$1.3 | 58.22,28.5 57.76,28.04 55.93,28.04 C17.2 | 58.22,28.5 59.89,26.82 61.11,26.82 61.87,27.58 61.87,29.11 U$1.2 62.03,29.26 62.79,29.26 65.38,31.85 66.57,31.85 67.18,32.46 75.13,32.46 75.74,31.85 76.35,31.85 76.66,32.16 76.66,33.07 | U8.8 83.67,25.15 83.06,25.15 81.99,26.21 81.99,29.57 82.14,29.72 U3.38 82.58,30.21 82.58,33.17 81.89,33.86 76.66,33.86 76.66,33.07 | 76.5,39.32 75.74,39.32 U3.39_13 | 76.5,39.32 76.5,40.08 U3.39_10 76.5,40.23 76.5,41.15 | 76.5,39.32 U3.39_2 76.5,39.17 76.5,38.41 U3.39_11 76.5,38.25 76.5,37.49 | U3.39_5 73.91,39.32 U3.39_18 | U3.39_5 74.68,40.08 U3.39_15 | U3.39_5 74.68,39.17 U3.39_16 74.68,38.25 U3.39_6 | 76.5,37.49 75.74,37.49 U3.39_14 74.83,37.49 U3.39_6 | U3.39_6 73.91,37.49 U3.39_19 73,37.49 U3.39_9 72.85,38.25 U3.39_21 72.85,39.17 U3.39_8 72.85,40.08 U3.39_20 | 76.5,37.49 U3.39_3 | 76.5,41.15 75.74,41.15 U3.39_12 74.83,41.15 U3.39_4 73.91,41.15 U3.39_17 73,41.15 U3.39_7 72.85,41.3 71.93,41.3 | 71.93,41.3 69.34,43.89 64.77,43.89 U3.15 64.62,44.04 v62.94,44.04 | 76.5,41.15 U3.39_1 | 76.66,33.07 73,33.07 71.02,35.05 71.02,40.39 71.93,41.3
  Top 0.152: v60.5,43.89 59.59,42.98 | U4.2 42.82,46.33 43.13,46.33 43.74,45.72 43.74,45.11 43.13,44.5 43.13,41.45 C4.2 43.13,41.3 44.65,41.3 47.24,38.71 49.23,38.71 | 50.9,45.41 50.9,46.94 C10.2 | 50.9,45.41 50.9,44.04 C9.2 50.75,43.89 50.75,43.59 49.38,42.22 49.38,41.15 C12.2 49.23,41 49.23,38.71 | 49.23,38.71 49.23,38.1 R12.1 49.07,37.95 C2.2 49.07,34.44 47.4,32.77 47.4,31.09 R10.1 47.24,30.94 46.79,30.94 44.2,28.35 C11.2 44.04,28.35 42.37,30.02 42.37,31.24 R11.1 42.22,31.39 41.91,31.39 38.41,34.9 C3.2 | 18.9,32 18.9,29.41 19.2,29.11 C6.2 | 18.9,32 18.9,33.22 R6.2 | 25.91,32.61 25.91,32.77 26.36,33.22 C7.2 26.52,33.38 27.58,33.38 28.35,34.14 28.96,34.14 29.57,33.53 29.57,32.92 30.94,31.55 36.88,31.55 37.34,32 | 25.91,32.61 25.91,30.18 | 25.91,30.18 25.91,29.41 C13.2 | 25.91,30.18 29.41,30.18 30.18,29.41 30.48,29.41 C14.2 | 24.08,32.77 24.08,33.83 25.91,35.66 25.91,36.42 J1.C5 | 24.08,32.77 24.23,32.61 25.91,32.61 | 18.9,32 23.32,32 24.08,32.77 | 40.08,14.63 39.93,14.78 U2.19 40.08,14.63 | 40.08,14.63 40.84,13.87 40.84,13.26 40.23,12.65 39.93,12.65 U2.21 39.93,12.5 39.93,12.34 39.93,6.25 41.45,4.72 41.45,4.67 | 37.34,34.29 37.64,34.29 38.25,34.9 C3.2 | 37.34,34.29 36.12,34.29 35.97,34.44 35.97,38.1 37.34,39.47 37.34,40.54 R2.1 | C1.2 42.82,34.44 42.82,35.05 41.76,36.12 39.47,36.12 38.41,35.05 C3.2 | 37.34,32 38.41,30.94 38.41,28.35 D3.A 38.56,28.19 39.78,26.98 39.78,21.34 U2.13 39.93,21.34 40.84,20.42 40.84,15.39 40.08,14.63 | 37.34,34.29 37.34,32 | 50.9,45.41 v52.43,45.41 | SW1.A' 1.83,30.63 1.83,32.77 2.44,33.38 R5.2 2.59,33.53 | 2.59,33.53 3.96,33.53 R5.1 4.12,33.53 7.16,33.53 R4.2
  Top 0.152: R4.2 7.32,33.53 8.84,33.53 R4.1 | SW1.A 5.94,30.63 7.32,30.63 7.47,30.79 D6.C | R4.2 7.32,33.38 7.32,31.09 7.47,30.94 D6.C | 2.59,33.53 2.59,40.08 K1.1 2.59,40.23 2.59,47.09 K2.1 | 10.21,28.19 14.48,28.19 15.24,28.96 15.24,31.7 13.56,33.38 13.26,33.38 R7.2 | 9.27,29.13 10.21,28.19 | 10.21,28.19 2.74,20.73 2.74,8.23 R1.P$1 | 9.27,29.13 7.62,30.79 D6.C | 9.27,29.13 C19.2 | U2.37 57.45,15.7 57.45,14.78 U2.36 57.3,14.63 56.84,14.17 55.02,14.17 U2.63 54.86,14.02 52.12,14.02 U2.75 | C18.2 51.97,28.65 49.53,28.65 48.92,28.04 C8.2 48.77,27.89 47.09,26.21 47.09,24.84 U2.8 47.09,24.69 47.09,24.38 48.31,23.16 49.84,23.16 50.6,22.4 U2.45 50.75,22.25 50.75,21.03 51.97,19.81 U2.69 | 54.86,19.66 54.86,18.44 U2.66 | 54.86,19.66 52.12,19.66 U2.69 | 54.86,19.66 U2.67 | U2.69 51.97,19.66 51.97,16.92 U2.76 51.97,16.76 51.97,14.02 U2.75 | U2.73 45.26,14.02 45.26,16.76 U2.72 45.26,16.92 45.26,19.66 U2.71 45.26,19.81 48.46,19.81 U2.70 48.62,19.66 48.62,16.92 U2.77 48.62,16.76 48.62,14.02 U2.74 48.62,13.87 49.99,12.5 | 49.99,10.21 50.44,10.21 51.21,9.45 51.21,9.14 U2.30 51.36,9.14 52.43,9.14 U2.31 52.58,8.99 52.58,8.23 53.65,7.16 54.25,7.16 55.17,8.08 55.17,8.53 | 49.99,10.21 48.92,10.21 48.16,9.45 48.16,9.14 U2.27 48.01,8.99 47.55,8.53 47.55,4.12 JP5.2 | 49.99,12.5 49.99,10.21 | 49.99,12.5 51.36,13.87 51.97,13.87 U2.75 | U6.9 79.4,7.16 76.2,3.96 JP8.2 76.2,3.81 74.37,1.98 68.73,1.98 66.9,3.81 JP3.2 | U6.1 64.01,24.23 64.01,22.4 U6.2 63.86,22.25 61.72,22.25 60.5,21.03 59.74,21.03 59.59,20.88 59.59,19.96 61.27,18.29 61.27,16.92 60.5,16.15 C16.2 60.5,16 60.5,14.48 C15.2 60.35,14.33 59.59,13.56 59.59,12.34 55.78,8.53
  Top 0.152: 55.17,8.53 55.78,8.53 | 55.17,8.53 54.71,8.99 U2.33 | 55.78,8.53 57,7.32 57,3.96 JP4.2 | 3.28,8 5.23,6.04 5.31,5.97 | 10.97,5.64 11.12,5.49 | 15.06,1.98 35.66,1.98 37.49,3.81 37.49,3.88 JP6.2
  Top 0.61: R1.P$1 3.18,8.1 3.28,8 3.68,7.59 3.68,7.36 3.95,7.09 4.19,7.09 5.23,6.04 | 5.31,5.97 10.64,5.97 10.97,5.64 | 11.12,5.49 13.8,2.81 13.8,2.62 14.52,1.9 35.52,1.9 37.49,3.88 | JP6.2 39.69,1.75 41.83,1.75 41.83,5.6 39.93,7.5 39.93,12.34
  Bottom 0.152: U1.25 85.8,20.57 85.19,21.18 85.19,22.4 U1.2 85.19,22.55 85.19,23.32 86.41,24.54 v86.41,27.13 85.65,27.13 85.19,27.58 84.58,27.58 | v81.53,24.84 81.84,24.84 84.58,27.58 | J5.1 86.56,45.87 v84.73,47.7 84.12,47.7 76.66,40.23 U3.39_10 | v62.94,44.04 62.79,43.89 v60.5,43.89 58.06,43.89 56.54,45.41 v52.43,45.41 | 84.58,27.58 84.58,28.19 76.81,35.97 76.81,36.27 75.74,37.34 U3.39_14 | JP6.2 37.64,3.81 37.95,3.81 39.8,1.96 45.39,1.96 47.4,3.96 JP5.2 | J2.5 84.28,10.36 82.75,10.36 76.35,3.96 JP8.2 | JP3.2 66.75,3.81 66.45,3.81 64.62,1.98 58.98,1.98 57.15,3.81 JP4.2
N$1  (via drill 0.35)
  Top 0.152: v84.12,24.23 84.89,24.99 88.24,24.99 U8.1 | v76.05,32.46 75.59,32.46 75.29,32.77 v66.29,32.77 | v59.74,33.22 57.45,33.22 57.15,33.53 L1.P$2
  Bottom 0.152: v84.12,24.23 81.23,24.23 79.4,26.06 79.4,32.23 78.28,33.35 76.94,33.35 v76.05,32.46 | v59.74,33.22 60.66,34.14 64.92,34.14 v66.29,32.77
N$2  (via drill 0.35)
  Top 0.152: v86.39,16.64 84.72,14.97 83.22,14.97 82.75,14.49 82.75,13.66 83.51,12.9 83.51,12.4 82.63,11.51 82.63,11.25 v82.53,11.25
  Bottom 0.152: 85.19,11.73 84.43,11.73 J2.3 83.01,11.73 v82.53,11.25 | U1.3 85.65,22.55 85.65,23.32 86.41,24.08 87.17,24.08 88.85,22.4 88.85,17.98 87.58,16.71 86.46,16.71 v86.39,16.64
N$3  (via drill 0.35)
  Top 0.152: v86.72,23.47 87.78,23.47 88.54,22.71 88.54,21.64 82.14,15.24 82.14,13.41 v82.91,12.65
  Bottom 0.152: v86.72,23.47 86.26,23.01 86.26,22.55 U1.4 | v82.91,12.65 83.21,12.65 83.36,12.5 84.28,12.5 J2.2
N$4
  Top 0.152: R3.1 38.56,38.1 38.56,38.71 40.69,40.84 40.69,43.28 42.67,45.26 U4.3
N$5  (via drill 0.35)
  Top 0.152: v81.84,20.12 80.47,21.49 78.03,21.49 76.96,22.55 v76.96,23.16 | v77.88,27.43 77.88,29.26 78.33,29.72 U3.35
  Bottom 0.152: v81.84,20.12 82.14,19.81 83.82,19.81 U1.20 | v76.96,23.16 76.96,26.52 v77.88,27.43
N$6  (via drill 0.35)
  Top 0.152: v82.14,21.03 82.14,21.95 v81.38,22.71 | v77.27,28.19 77.27,29.57 77.11,29.72 U3.34
  Bottom 0.152: v82.14,21.03 82.91,20.27 83.82,20.27 U1.21 | v81.38,22.71 81.38,23.62 79.1,25.91 79.1,27.13 78.03,28.19 v77.27,28.19
N$7
  Top 0.152: U4.1 42.67,47.24 41.6,47.24 38.41,44.04 D1.C 38.08,43.71 38.08,39.23 36.89,38.04 R3.2 36.88,36.42 | 36.88,36.42 36.88,35.05 C3.1 | 36.88,36.42 43.74,36.42 U5.2
N$8  (via drill 0.35)
  Top 0.152: v82.6,26.98 83.21,26.36 83.67,26.36 U8.6 | v44.35,35.2 44.35,31.7 44.04,31.39 R11.2
  Bottom 0.152: v82.6,26.98 82.6,29.72 76.5,35.81 76.5,36.12 76.2,36.42 67.97,36.42 67.82,36.27 66.9,36.27 61.72,41.45 61.72,42.67 61.42,42.98 52.43,42.98 49.68,40.23 47.09,40.23 44.35,37.49 v44.35,35.2
N$9  (via drill 0.35)
  Top 0.813: v12.57,45.74 12.57,44.63 v7.67,39.73
  Bottom 0.152: 30.79,6.83 30.79,6.88 | 30.79,8.99 R1.P$4 | 12.57,47.24 12.65,47.24 K2.3
  Bottom 0.813: 30.79,6.83 30.84,6.83 31.98,5.69 31.98,2.69 31.01,1.73 6.44,1.73 6.07,2.1 6.07,2.11 4.95,3.23 JP2.1 4.95,5.13 7.29,7.47 7.29,22.25 3.81,25.73 3.81,37.39 4.72,38.3 6.25,38.3 v7.67,39.73 | 30.79,6.88 30.79,8.99 | v12.57,45.74 12.57,47.24
N$10
  Top 0.152: D5.C 54.86,46.94 52.73,44.81 52.58,44.81 51.66,43.89 51.66,38.86 50.9,38.1 R12.2
N$11
  Top 0.152: RPROG.1 53.19,41 54.41,39.78 57,39.78 57.61,39.17 U7.5
N$12  (via drill 0.35)
  Top 0.152: v56.54,24.23 56.84,24.54 59.44,24.54 59.89,24.08 60.35,24.08 R8.1 | v50.14,30.63 49.38,30.63 49.07,30.94 R10.2 | v84.89,26.98 83.82,26.98 U8.5
  Bottom 0.152: v50.14,30.63 v56.54,24.23 56.54,20.27 62.03,14.78 62.79,14.78 67.06,19.05 72.85,19.05 75.44,21.64 82.45,21.64 84.89,24.08 v84.89,26.98
N$13
  Top 0.152: D4.A 53.03,43.89 53.03,42.98 51.97,41.91 51.97,35.05 51.82,34.9 51.82,31.24 R9.1
N$14
  Top 0.152: D4.C 55.02,43.89 56.08,43.89 59.44,40.54 59.44,39.62 59.89,39.17 60.2,39.17 U7.1
N$15
  Top 0.152: 34.59,8.99 34.68,9.09 R1.P$3
  Top 0.813: JP7.1 22.92,6.71 33.91,6.71 34.68,7.47 34.68,9.09
  Bottom 0.813: JP2.3 10.08,3.96 12.11,3.96 14.3,6.15 18.35,6.15 20.1,4.39 JP7.1
N$16
  Bottom 0.152: JP1.1 30.02,4.12 30.02,8.23 25.15,13.11 25.15,21.34 20.42,26.06 20.42,40.08 K1.4
N$17
  Bottom 0.152: JP1.3 24.84,4.12 24.84,16.15 16.15,24.84 13.59,24.84 12.8,25.63 12.8,40.08 K1.3
N$18
  Top 0.152: 15.09,23.57 15.09,23.72
  Top 0.813: JP7.3 15.02,23.5 15.09,23.57 | 15.09,23.72 16.05,24.69 16.33,24.69 16.33,32.81 16,33.14 16,33.92 16.33,34.24 16.33,41.19 20.32,45.17 K2.4
N$19  (via drill 0.35)
  Top 0.152: v31.7,43.59 36.88,48.77 76.96,48.77 78.33,47.4 78.33,46.94 U3.4 | v31.7,28.19 31.7,13.56 39.93,5.33 39.93,3.96 JP6.3
  Bottom 0.152: v31.7,28.19 v31.7,43.59
N$20
  Top 0.152: R19.2 14.02,30.94 13.26,30.18 10.36,30.18 9.75,30.79 D6.A
N$21  (via drill 0.35)
  Top 0.152: v76.96,45.26 76.96,46.79 U3.5 | v71.63,39.93 71.63,34.9 72.85,33.68 v75.74,33.68 | v73,13.87 v73,21.49
  Bottom 0.152: v71.63,39.93 v76.96,45.26 | v75.74,33.68 75.74,33.07 75.26,32.59 75.26,23.75 v73,21.49 | v73,13.87 73,5.33 69.34,1.68 52.27,1.68 49.99,3.96 JP5.3
N$22
  Top 0.152: U3.33 75.89,29.72 75.89,28.35 78.79,25.45 81.84,25.45 83.06,24.23 83.06,17.53 81.43,15.9 81.43,6.6 78.79,3.96 JP8.3
N$23  (via drill 0.35)
  Top 0.152: v78.49,26.67 79.55,27.74 79.55,29.72 U3.36 | v73.76,13.11 v73.76,20.88
  Bottom 0.152: v78.49,26.67 78.49,23.77 76.66,21.95 74.83,21.95 v73.76,20.88 | v73.76,13.11 73.76,6.25 75.29,4.72 75.29,2.74 75.89,2.13 79.7,2.13 81.38,3.81 JP8.4
N$24
  Top 0.152: U3.24 64.62,32.46 55.78,32.46 54.25,30.94 54.25,30.48 53.49,29.72 47.4,29.72 44.2,26.52 44.2,23.93 43.43,23.16 42.98,23.16 41.45,21.64 41.45,8.84 44.5,5.79 45.26,5.79 46.33,4.72 46.33,2.9 47.09,2.13 57.91,2.13 59.59,3.81 JP4.3
N$25  (via drill 0.35)
  Top 0.152: v67.06,27.58 67.06,29.72 U3.26 | v67.06,20.42 67.06,19.81 v68.73,18.14 | v68.73,8.38 64.31,3.96 JP3.3
  Bottom 0.152: v67.06,20.42 v67.06,27.58 | v68.73,8.38 v68.73,18.14
N$26  (via drill 0.35)
  Top 0.152: v55.93,34.75 58.52,34.75 61.72,37.95 61.72,43.74 62.79,44.81 65.53,44.81 66.9,46.18 66.9,46.79 U3.13 | v61.57,20.57 63.86,18.29 U6.4
  Bottom 0.152: v55.93,34.75 55.93,30.94 61.57,25.3 v61.57,20.57
N$27  (via drill 0.35)
  Top 0.152: 20.42,33.83 20.42,33.38 R6.1 | 20.42,33.83 19.51,34.75 18.16,34.75 v16.94,33.53 | v51.66,48.01 52.12,48.46 69.65,48.46 70.71,47.4 70.71,46.94 U3.10 | v42.06,38.41 39.78,38.41 v39.47,38.1 | 20.42,33.83 v21.03,34.44
  Bottom 0.152: v16.94,33.53 13.87,36.6 13.87,40.54 13.11,41.3 6.25,41.3 5.18,40.23 K1.2 | v42.06,38.41 v51.66,48.01 | v39.47,38.1 38.1,38.1 32,44.2 30.79,44.2 v21.03,34.44
N$28  (via drill 0.35)
  Top 0.152: R7.1 14.76,33.47 14.76,36.68 v14.63,36.8 | U3.11 69.19,46.52 69.19,44.5 71.63,42.06 77.27,42.06 77.42,41.91 77.42,36.58 76.66,35.81 v75.89,35.81 | v63.7,29.26 63.7,28.96 61.27,26.52 v58.52,26.52 | v21.34,26.52 20.07,26.52 18.57,28.02 v17.55,28.02
  Bottom 0.152: K2.2 5.18,47.09 7.77,47.09 14.63,40.23 v14.63,36.8 17.55,33.88 v17.55,28.02 | v75.89,35.81 68.73,28.65 64.31,28.65 v63.7,29.26 | v58.52,26.52 58.06,26.52 52.73,31.85 42.82,31.85 37.49,26.52 v21.34,26.52
N$29
  Top 0.152: U3.30 72.08,29.72 72.08,28.96 78.64,22.4 79.4,22.4 U6.15
N$30  (via drill 0.35)
  Top 0.152: v67.18,45.19 68.28,46.28 68.28,46.79 U3.12 | v70.92,43.87 71.14,44.09 76.1,44.09 82.91,37.29 v82.91,36.88 | v86.41,28.8 87.48,27.74 v87.63,27.74 | v87.94,24.23 86.56,24.23 83.67,21.34 v83.67,18.44 | v81.08,19.36 80.47,19.36 79.55,20.27 U6.14
  Bottom 0.152: 67.11,45.19 v67.18,45.19 70.38,45.19 70.92,44.65 v70.92,43.87 | v82.91,36.88 82.91,32.31 v86.41,28.8 | v87.63,27.74 87.63,24.54 v87.94,24.23 | v83.67,18.44 81.99,18.44 v81.08,19.36
N$31
  Top 0.152: U3.31 73.3,29.72 73.3,28.19 78.18,23.32 81.69,23.32 82.75,22.25 82.75,20.12 81.08,18.44 79.55,18.44 U6.13
N$32
  Top 0.152: U3.29 70.87,29.72 70.87,24.69 79.1,16.46 79.4,16.46 U6.12
N$33  (via drill 0.35)
  Top 0.152: v75.74,45.11 75.74,46.79 U3.6 | v69.65,34.29 v69.65,39.01 | v64.62,27.58 v64.62,29.26 | v65.84,19.2 65.84,17.98 64.31,16.46 64.01,16.46 U6.5
  Bottom 0.152: v69.65,39.01 v75.74,45.11 | v64.62,29.26 v69.65,34.29 | v64.62,27.58 66.45,25.76 66.45,19.81 v65.84,19.2
N$34
  Top 0.152: U2.1 54.71,24.84 62.18,24.84 64.16,26.82 67.21,26.82 68.12,27.74 68.12,29.72 U3.27
N$35  (via drill 0.35)
  Top 0.152: v54.1,29.11 53.49,28.5 53.49,24.84 U2.2 | v65.84,25.45 66.29,25.45 69.34,28.5 69.34,29.72 U3.28
  Bottom 0.152: v54.1,29.11 55.02,29.11 58.52,25.6 58.52,22.71 61.27,19.96 61.87,19.96 65.84,23.93 v65.84,25.45
N$36  (via drill 0.35)
  Top 0.152: 24.84,36.58 20.88,32.61 20.12,32.61 19.81,32.92 19.81,33.98 19.36,34.44 18.44,34.44 17.83,33.83 17.83,29.11 C6.1 | 24.84,36.58 24.84,45.72 25.91,46.79 25.91,48.16 J1.C1 | v28.65,32.31 28.8,32.31 32.31,28.8 32.31,22.71 39.17,15.85 39.78,15.85 U2.18 | 24.84,36.58 v24.38,36.58
  Bottom 0.152: v24.38,36.58 v28.65,32.31
N$37
  Top 0.152: R15.1 33.07,29.57 33.07,24.54 39.47,18.14 39.78,18.14 U2.16
N$38  (via drill 0.35)
  Top 0.152: v33.07,32.16 33.07,33.22 R14.1 | v38.41,18.14 39.78,16.76 U2.17
  Bottom 0.152: v33.07,32.16 33.07,30.94 35.2,28.8 35.2,28.19 34.29,27.28 23.62,27.28 23.16,27.74 21.64,27.74 20.73,26.82 20.73,26.21 28.8,18.14 v38.41,18.14
N$39
  Top 0.152: 30.48,42.52 28.5,44.5 28.5,48.16 J1.C2 | 30.48,42.52 34.44,38.56 34.44,33.38 R14.2 | 30.48,42.52 25.15,37.19 25.15,36.42 21.03,32.31 19.96,32.31 19.51,32.77 19.51,33.83 19.2,34.14 18.59,34.14 18.14,33.68 18.14,32.92 18.44,32.61 18.44,28.5 18.59,28.35 22.55,28.35 23.32,27.58 25.6,27.58 27.28,29.26 28.96,29.26 C14.1
N$40  (via drill 0.35)
  Top 0.152: v34.59,28.5 34.59,29.57 R15.2 | v25.3,28.19 24.23,29.26 C13.1 | v31.09,42.82 31.09,48.16 J1.C3
  Bottom 0.152: v34.59,28.5 32.92,28.5 32,27.58 31.09,27.58 | 31.09,27.58 25.91,27.58 v25.3,28.19 | 31.09,27.58 v31.09,42.82
N$41
  Top 0.152: 30.33,34.44 30.33,35.81 30.94,36.42 J1.C7 | 30.33,34.44 30.33,33.38 R16.2 | 30.33,34.44 26.06,34.44 24.99,33.38 C7.1
N$42
  Top 0.152: R16.1 28.65,33.22 31.55,30.33 33.38,30.33 33.98,29.72 33.98,24.69 39.47,19.2 39.78,19.2 U2.15
N$43  (via drill 0.35)
  Top 0.152: R17.2 60.2,21.95 59.28,21.03 59.28,18.75 60.35,17.68 C16.1 60.35,17.53 59.28,16.46 59.28,12.95 v55.47,9.14 | v53.95,7.77 53.65,8.08 53.65,8.99 U2.32
  Bottom 0.152: v53.95,7.77 55.32,9.14 v55.47,9.14
N$44
  Top 0.152: R18.1 57.15,31.09 54.41,28.35 54.41,28.04 C17.1 54.25,27.89 54.1,27.74 54.1,23.93 54.86,23.16 54.86,21.18 U2.68
N$45
  Top 0.152: R17.1 60.35,20.27 60.35,19.66 61.57,18.44 61.57,14.02 60.5,12.95 C15.1 60.5,12.8 60.66,12.65 60.66,9.6 JP9.1
N$46  (via drill 0.35)
  Top 0.152: v52.12,7.77 50.14,7.77 49.23,8.69 49.23,8.99 U2.28 | v62.03,12.65 62.03,15.09 v62.33,15.39 | v74.57,31.8 74.27,32.11 71.27,32.11 v71.02,31.85 | v71.02,34.14 71.02,34.59 70.71,34.9 v70.71,41.6 | U3.7 74.57,46.8 v74.57,45.21
  Bottom 0.152: v52.12,7.77 53.03,7.77 55.02,9.75 59.13,9.75 v62.03,12.65 | v62.33,15.39 62.94,15.39 74.75,27.2 74.75,31.62 v74.57,31.8 | v71.02,34.14 v71.02,31.85 | v74.57,45.21 74.57,44.55 71.63,41.6 v70.71,41.6
N$47  (via drill 0.35)
  Top 0.152: 58.67,31.55 60.35,29.87 60.35,27.74 U$1.1 | 58.67,31.55 58.22,32 56.84,32 56.08,31.24 55.63,31.24 R18.2 | v52.88,26.06 51.21,27.74 C18.1 | v57.91,23.62 v55.32,23.62 | v56.39,26.82 55.63,26.82 55.02,27.43 55.02,28.5 57,30.48 57.61,30.48 58.67,31.55
  Bottom 0.152: v55.32,23.62 v52.88,26.06 | v57.91,23.62 57.91,25.3 v56.39,26.82
N$48  (via drill 0.35)
  Top 0.152: D5.A 53.19,47.09 53.65,47.09 54.41,47.85 58.52,47.85 58.83,47.55 D2.C 58.98,47.4 61.11,45.26 v61.11,42.37 | v73.15,34.29 82.07,34.29 82.91,33.45 82.91,29.57 83.36,29.11 83.67,29.11 85.5,27.28 85.5,26.67 84.58,25.76 83.82,25.76 U8.7 | v56.54,25.76 60.35,25.76 R8.2 | v53.19,29.11 48.31,29.11 47.24,28.04 C8.1 | JP3.1 69.34,3.81 73.76,3.81 JP8.1 | 39.93,31.24 38.56,32.61 D3.C | 39.93,31.24 v40.39,30.79 42.22,28.96 42.22,28.35 C11.1 | 39.93,31.24 39.01,30.33 39.01,29.57 41.15,27.43 41.15,7.77 44.81,4.12 JP5.1
  Bottom 0.152: v73.15,34.29 72.39,34.29 70.71,35.97 66.14,35.97 61.11,41 v61.11,42.37 52.73,42.37 50.29,39.93 47.24,39.93 46.18,38.86 46.18,36.12 40.84,30.79 v40.39,30.79 | v56.54,25.76 v53.19,29.11 50.75,31.55 46.63,31.55 43.13,28.04 43.13,5.79 | 43.13,5.79 36.88,5.79 35.05,3.96 JP6.1 | 43.13,5.79 44.81,4.12 JP5.1 44.96,4.12 46.63,5.79 50.44,5.79 52.27,3.96 54.41,3.96 JP4.1 54.56,3.96 56.39,5.79 67.06,5.79 68.89,3.96 69.19,3.96 JP3.1
N$49  (via drill 0.35)
  Top 0.152: U3.8 73.33,46.78 73.33,45.24 73.28,45.19 v73.13,45.19 | v72.62,43.49 72.8,43.3 76.46,43.3 81.02,38.74 81.02,37.34 v81.94,36.42 | v81.97,32.33 81.28,31.65 78.28,31.65 v78.28,31.62 | v76,23.85 76,21.21 v76.94,20.27 | v71.93,17.98 71.93,15.21 71.91,15.19 71.91,15.14 v71.93,15.11 | 47.85,10.43 v48.16,10.43 U2.62
  Bottom 0.152: v73.13,45.19 72.62,44.68 72.62,43.69 72.06,43.69 72.26,43.49 v72.62,43.49 | v81.94,36.42 82.04,36.33 82.04,32.41 v81.97,32.33 | v78.28,31.62 76.02,29.36 76.02,23.85 v76,23.85 | v76.94,20.27 75.01,18.34 72.26,18.34 71.93,18.01 v71.93,17.98 | v71.93,15.11 71.37,15.68 71.37,16.36 71.02,16.71 70.51,16.71 69.77,15.97 69.77,8.56 68.37,7.17 51.87,7.17 50.62,8.42 50.62,11.03 50.49,11.15 49.77,10.43 v48.16,10.43
N$50  (via drill 0.35)
  Top 0.152: v25.3,47.09 24.08,48.31 19.81,48.31 19.05,47.55 19.05,44.81 12.19,37.95 12.19,32.16 12.34,32 12.34,30.94 R19.1 | v63.09,43.13 64.31,43.13 64.62,42.82 U3.16
  Bottom 0.152: v25.3,47.09 31.39,47.09 40.84,37.64 40.84,35.2 41.15,34.9 41.76,34.9 44.04,37.19 44.04,37.95 48.31,42.22 51.21,42.22 51.82,42.82 51.82,45.87 52.12,46.18 61.72,46.18 63.55,44.35 63.55,43.59 v63.09,43.13
N$51
  Bottom 0.152: 0,0 0,49.99 0.03,50.01 89.99,50.01 89.99,0.03 90.02,0 0.05,0 0.03,-0.03
N$52  (via drill 0.35)
  Top 0.152: U2.61 47.89,11.25 46.41,9.77 46.41,6.79 46.35,6.73 v46.27,6.82 | v70.76,16.1 70.76,23.57 69.37,24.97 69.37,26.8 v69.93,27.36 | v73.38,31.5 74.02,31.5 74.32,31.19 76.25,31.19 78.26,33.2 v81.18,33.2 | v80.42,36.75 80.42,37.06 78.03,39.45 v78.03,39.95 | v81.56,43.28 77.88,43.28 77.32,43.84 v77.32,43.89 | v75.79,42.7 71.91,42.7 v71.68,42.93 | v71.83,45.11 72.02,45.3 U3.9
  Bottom 0.152: v46.27,6.82 70.62,6.82 70.76,6.96 v70.76,16.1 | v69.93,27.36 73.25,30.68 73.25,31.37 v73.38,31.5 | v81.18,33.2 80.44,33.93 80.44,36.75 v80.42,36.75 | v78.03,39.95 79.49,41.41 79.49,42.24 79.62,42.38 80.32,42.38 81.38,43.43 81.41,43.43 v81.56,43.28 | v77.32,43.89 77.01,43.89 75.92,42.8 75.89,42.8 v75.79,42.7 | v71.68,42.93 71.68,44.96 v71.83,45.11
RESET  (via drill 0.35)
  Top 0.152: SW1.B' 1.83,28.96 5.79,28.96 SW1.B 5.96,28.98 7.41,28.98 C19.1 7.59,29.13 v8.84,27.89 | v10.52,28.96 12.5,28.96 R20.1 | v70.1,44.55 70.16,44.5 77.95,44.5 79.55,46.1 79.55,46.79 U3.3 | v63.09,41.45 63.09,38.71 v62.79,38.41 | v47.55,36.12 47.09,36.12 v46.33,35.36 | v22.86,27.13 17.75,22.02 v16.59,22.02
  Bottom 0.152: v8.84,27.89 9.91,28.96 | v70.1,44.55 66.19,44.55 v63.09,41.45 | v62.79,38.41 49.84,38.41 v47.55,36.12 | v46.33,35.36 45.87,35.36 37.34,26.82 23.16,26.82 v22.86,27.13 | v16.59,22.02 16.13,22.48 12.75,22.48 6.27,28.96 9.91,28.96 | 9.91,28.96 v10.52,28.96
V+  (via drill 0.35)
  Top 0.152: v87.94,22.4 87.94,21.69 81.81,15.57 81.81,6.53 80.01,4.72 80.01,2.74 79.4,2.13 78.49,2.13 77.88,2.74 77.88,5.18 81.08,8.38 81.08,10.97 80.47,11.58 74.37,11.58 65.68,20.27 64.01,20.27 U6.3 63.86,20.42 63.25,20.42 v62.18,21.49 | C2.1 47.4,34.44 46.79,33.83 46.02,33.83 45.41,34.44 45.41,35.05 44.65,35.81 44.04,35.81 43.74,35.51 43.74,33.68 43.59,33.53 42.22,33.53 41.45,34.29 C1.1 41.45,34.44 v41.45,35.51 | v15.24,38.41 12.5,35.66 12.5,32.92 12.8,32.61 13.87,32.61 14.94,31.55 14.94,30.33 14.17,29.57 14.17,29.11 R20.2 | v43.89,47.85 44.5,47.85 44.96,47.4 U4.5 | 51.05,35.51 51.05,36.27 49.99,37.34 49.99,41.91 v50.9,42.82 | 51.05,35.51 51.05,34.44 C5.1 | v41.6,43.28 41.6,41.45 C4.1 | v80.01,45.26 80.77,46.02 80.77,46.79 U3.2 | 51.05,35.51 v51.36,35.51
  Bottom 0.152: U1.5 86.72,22.4 87.02,22.4 U1.6 87.17,22.4 87.48,22.1 | 87.48,22.1 87.78,21.79 U1.7 | 87.48,22.1 87.78,22.4 v87.94,22.4 | v15.24,38.41 15.24,39.52 24.46,48.74 41.6,48.74 41.6,48.31 | 41.6,48.31 43.43,48.31 v43.89,47.85 44.65,48.62 51.97,48.62 52.27,48.31 52.27,47.7 | v50.9,42.82 50.9,46.33 52.27,47.7 | 41.6,48.31 v41.6,43.28 41.45,43.13 v41.45,35.51 | v80.01,45.26 77.88,45.26 75.44,47.7 52.27,47.7 | v62.18,21.49 62.18,29.41 56.08,35.51 v51.36,35.51
VBATT  (via drill 0.35)
  Top 0.152: v87.02,26.36 88.24,26.36 U8.3 | 52.43,40.23 53.34,40.23 54.56,39.01 54.86,39.01 R13.2 | 52.43,40.23 52.27,40.39 52.27,41.76 54.1,43.59 54.1,44.5 54.41,44.81 55.63,44.81 57.15,43.28 | 57.15,43.28 59.44,41 60.2,41 U7.3 | U2.34 57.45,12.65 57.45,13.56 U2.35 57.45,13.72 57.76,13.72 58.98,14.94 58.98,23.77 v59.13,23.93 | C10.1 49.07,46.94 49.07,45.87 47.55,44.35 47.55,41.15 C12.1 47.55,41 v47.55,39.32 | v46.79,38.25 46.02,37.49 U5.3 | v53.19,33.07 56.54,36.42 57,36.42 L1.P$1 | 52.43,40.23 52.43,39.62 52.27,39.47 52.27,38.1 v52.58,37.8 | 57.15,43.28 v57.45,43.59
  Bottom 0.152: 87.02,37.8 87.02,43.43 86.72,43.74 J5.2 | 87.02,37.8 v87.02,26.36 | v47.55,39.32 46.79,38.56 v46.79,38.25 46.79,35.97 47.24,35.51 50.44,35.51 | v59.13,23.93 59.13,26.82 53.03,32.92 | 50.44,35.51 53.03,32.92 | 53.03,32.92 v53.19,33.07 | v52.58,37.8 52.12,37.8 50.44,36.12 50.44,35.51 | 87.02,37.8 76.2,37.8 75.89,38.1 75.29,38.1 74.98,37.8 74.37,37.8 74.07,38.1 73.46,38.1 73.15,37.8 65.84,37.8 62.03,41.6 62.03,42.82 61.57,43.28 57.76,43.28 v57.45,43.59